# Altium schematic sheet MAX2082_transceiver_V1.0.SchDoc
size 1198 x 708 mm
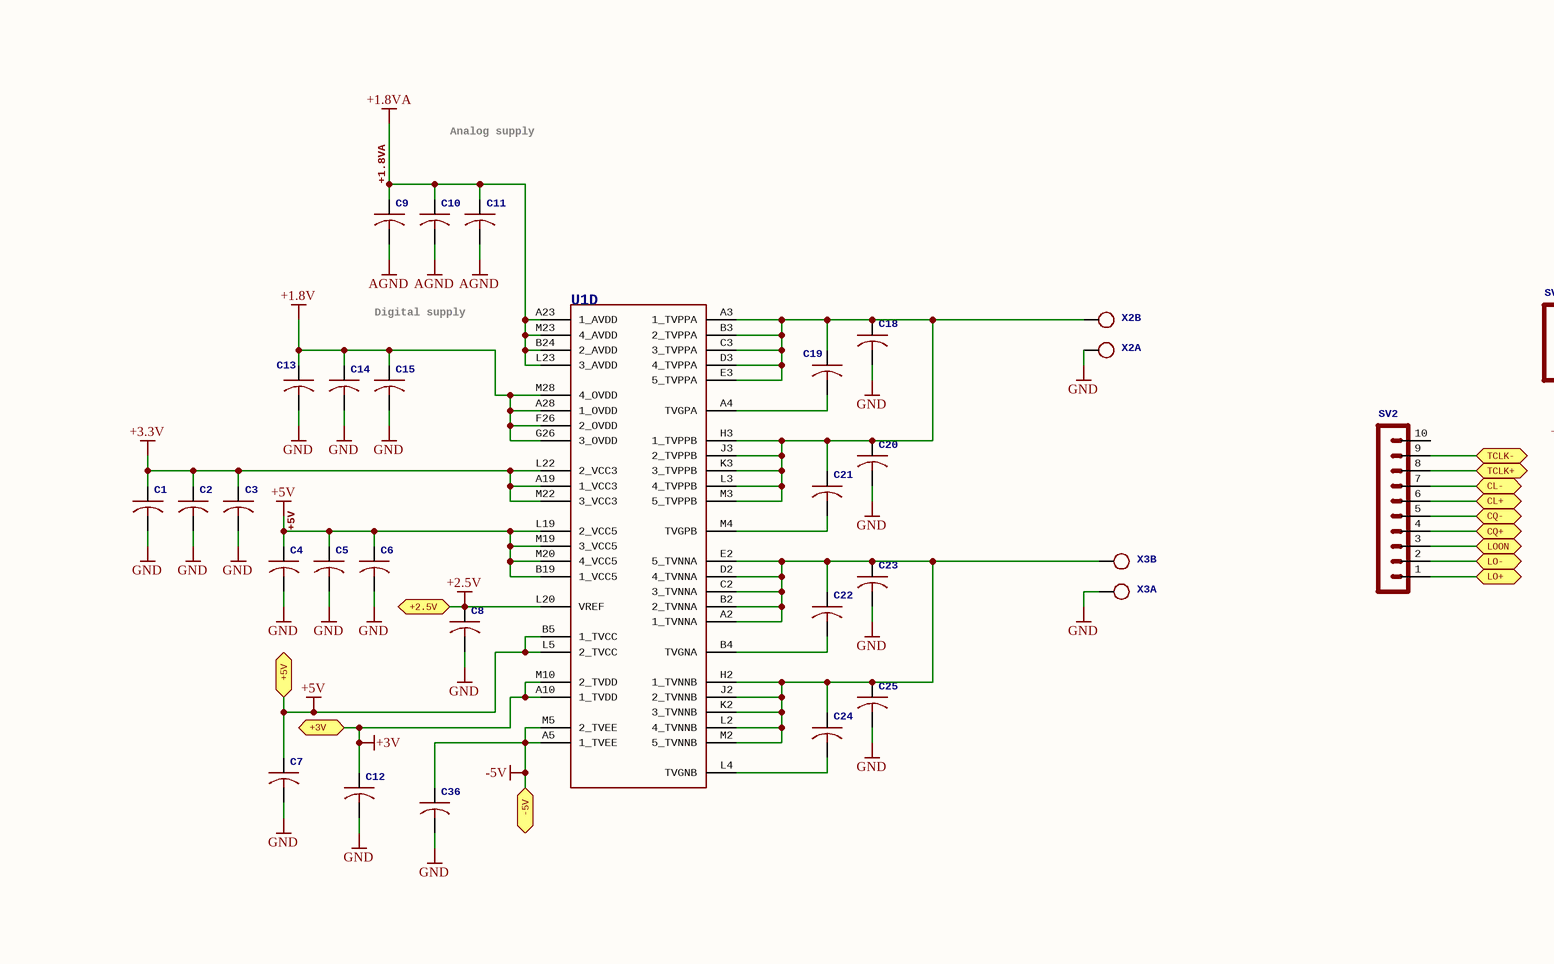
[diagram p0: MAX2082_transceiver_V1.0.SchDoc, top column 1 of 4]
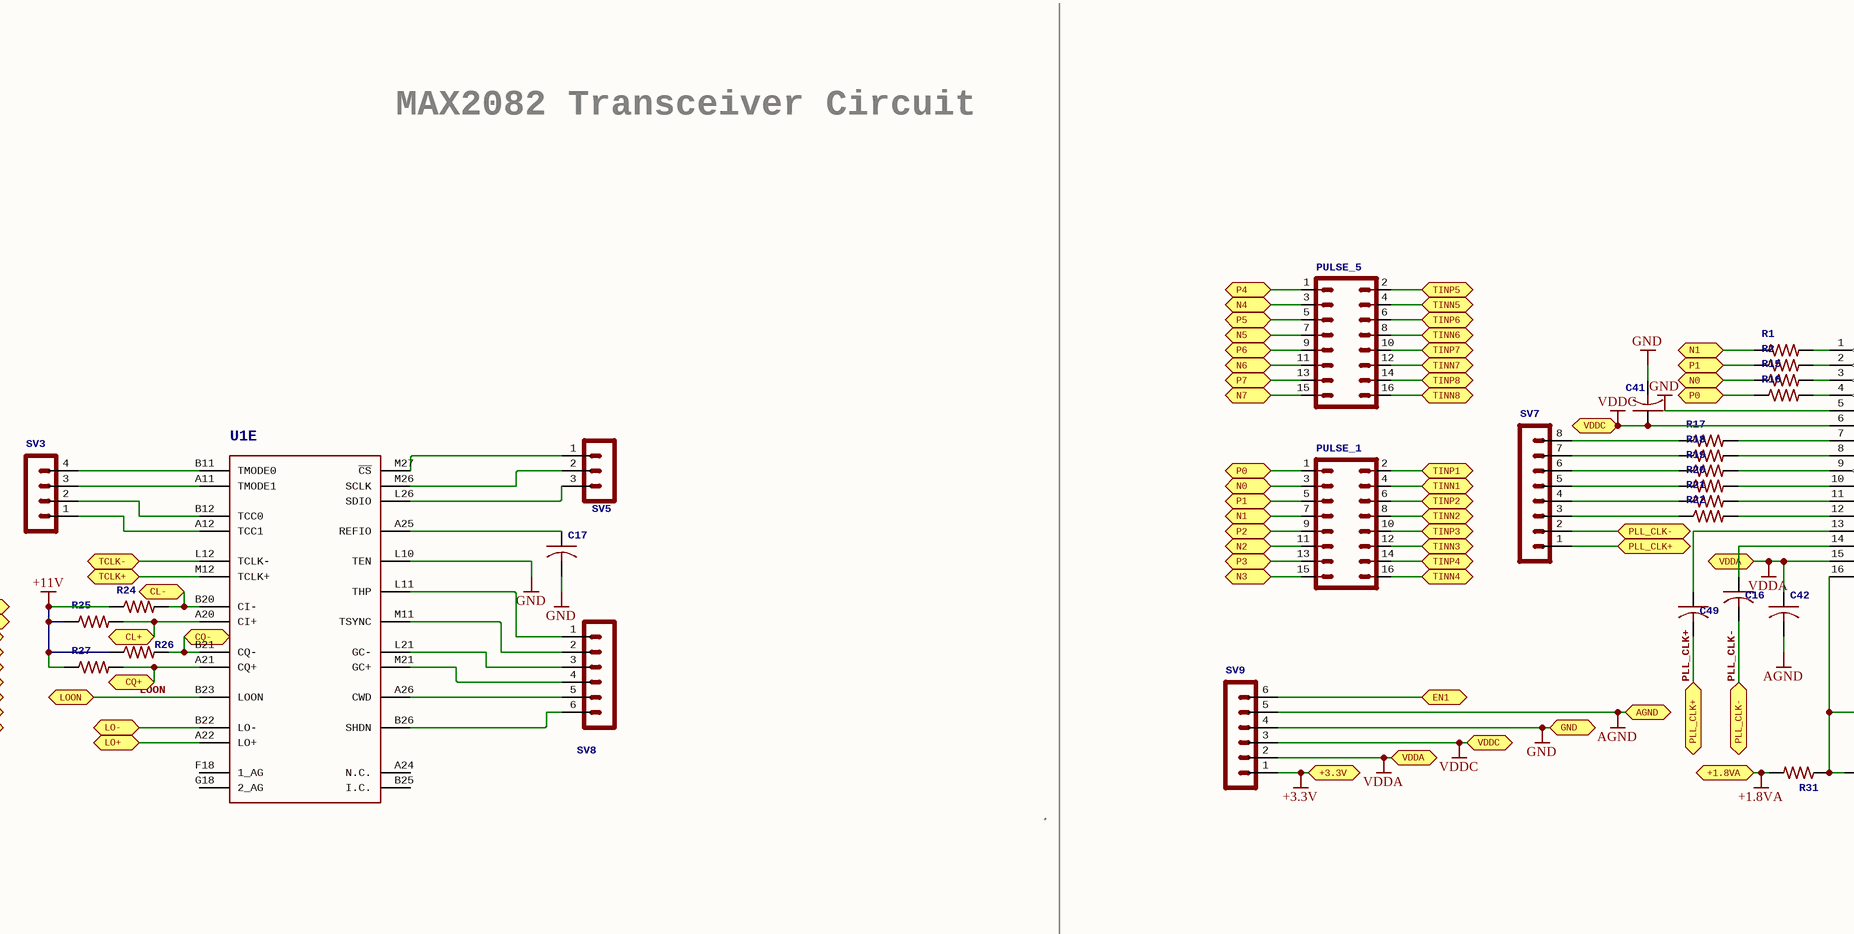
[diagram p1: MAX2082_transceiver_V1.0.SchDoc, top column 2 of 4]
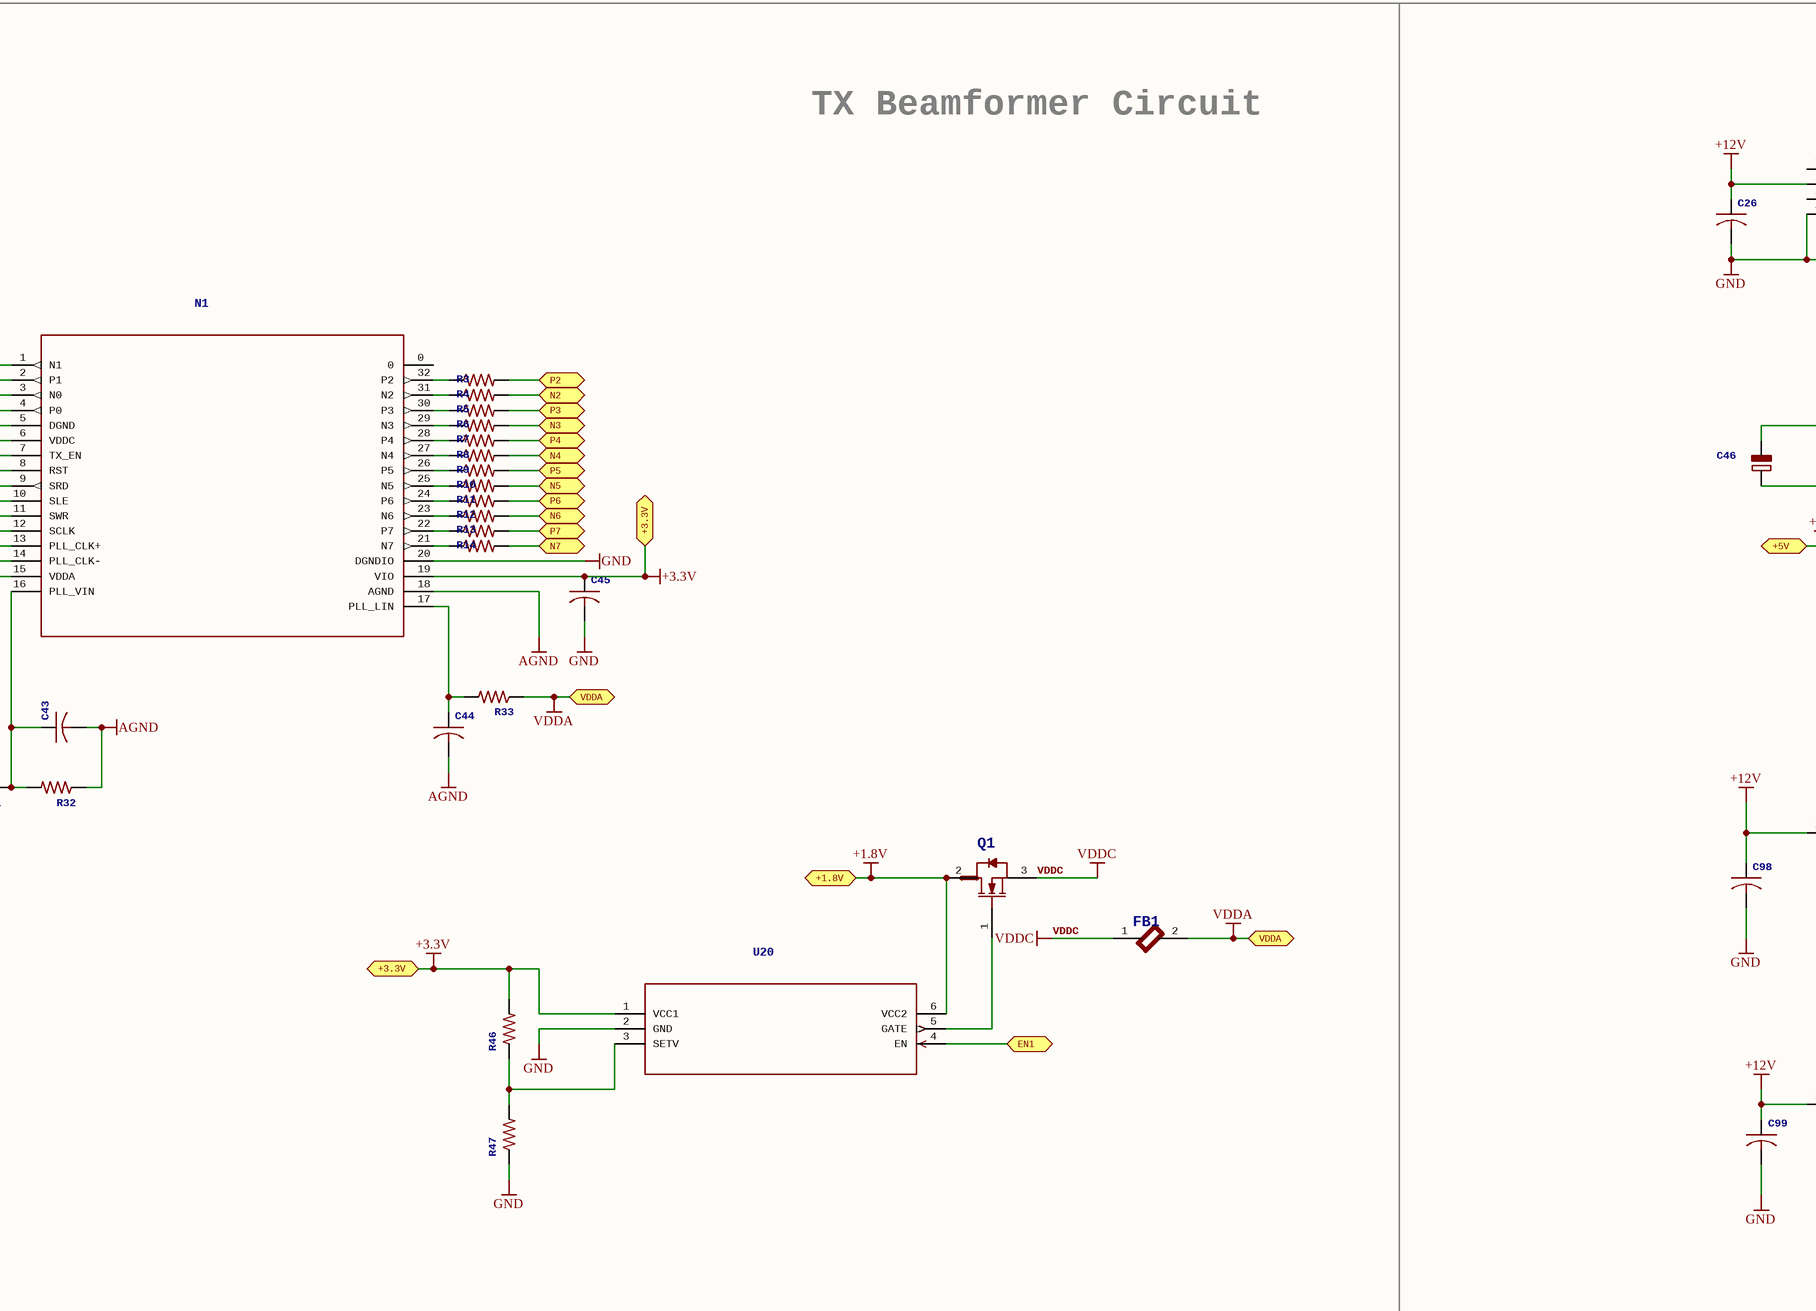
[diagram p2: MAX2082_transceiver_V1.0.SchDoc, top column 3 of 4]
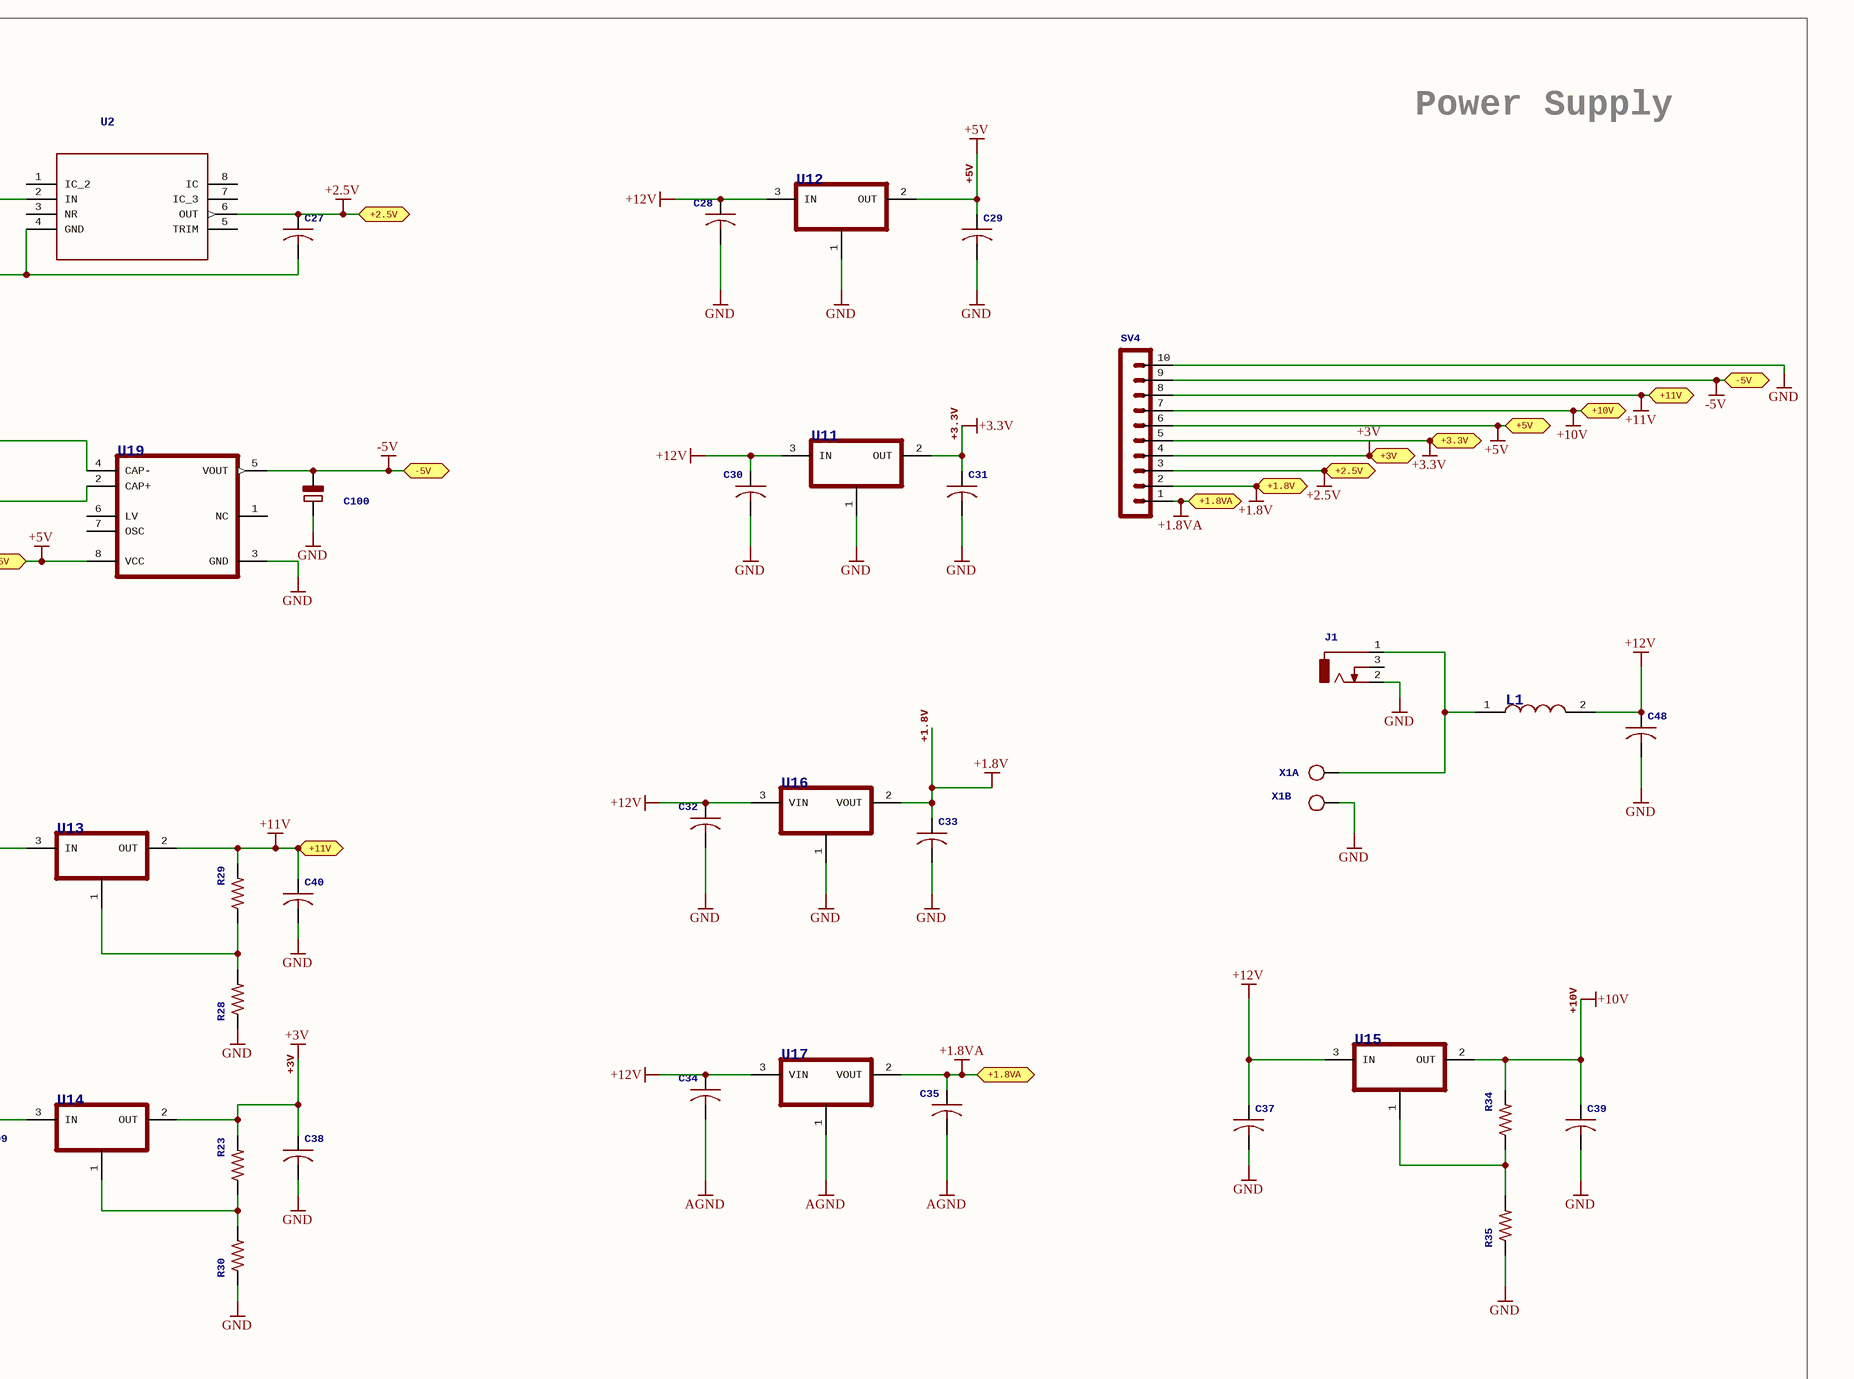
[diagram p3: MAX2082_transceiver_V1.0.SchDoc, top column 4 of 4]
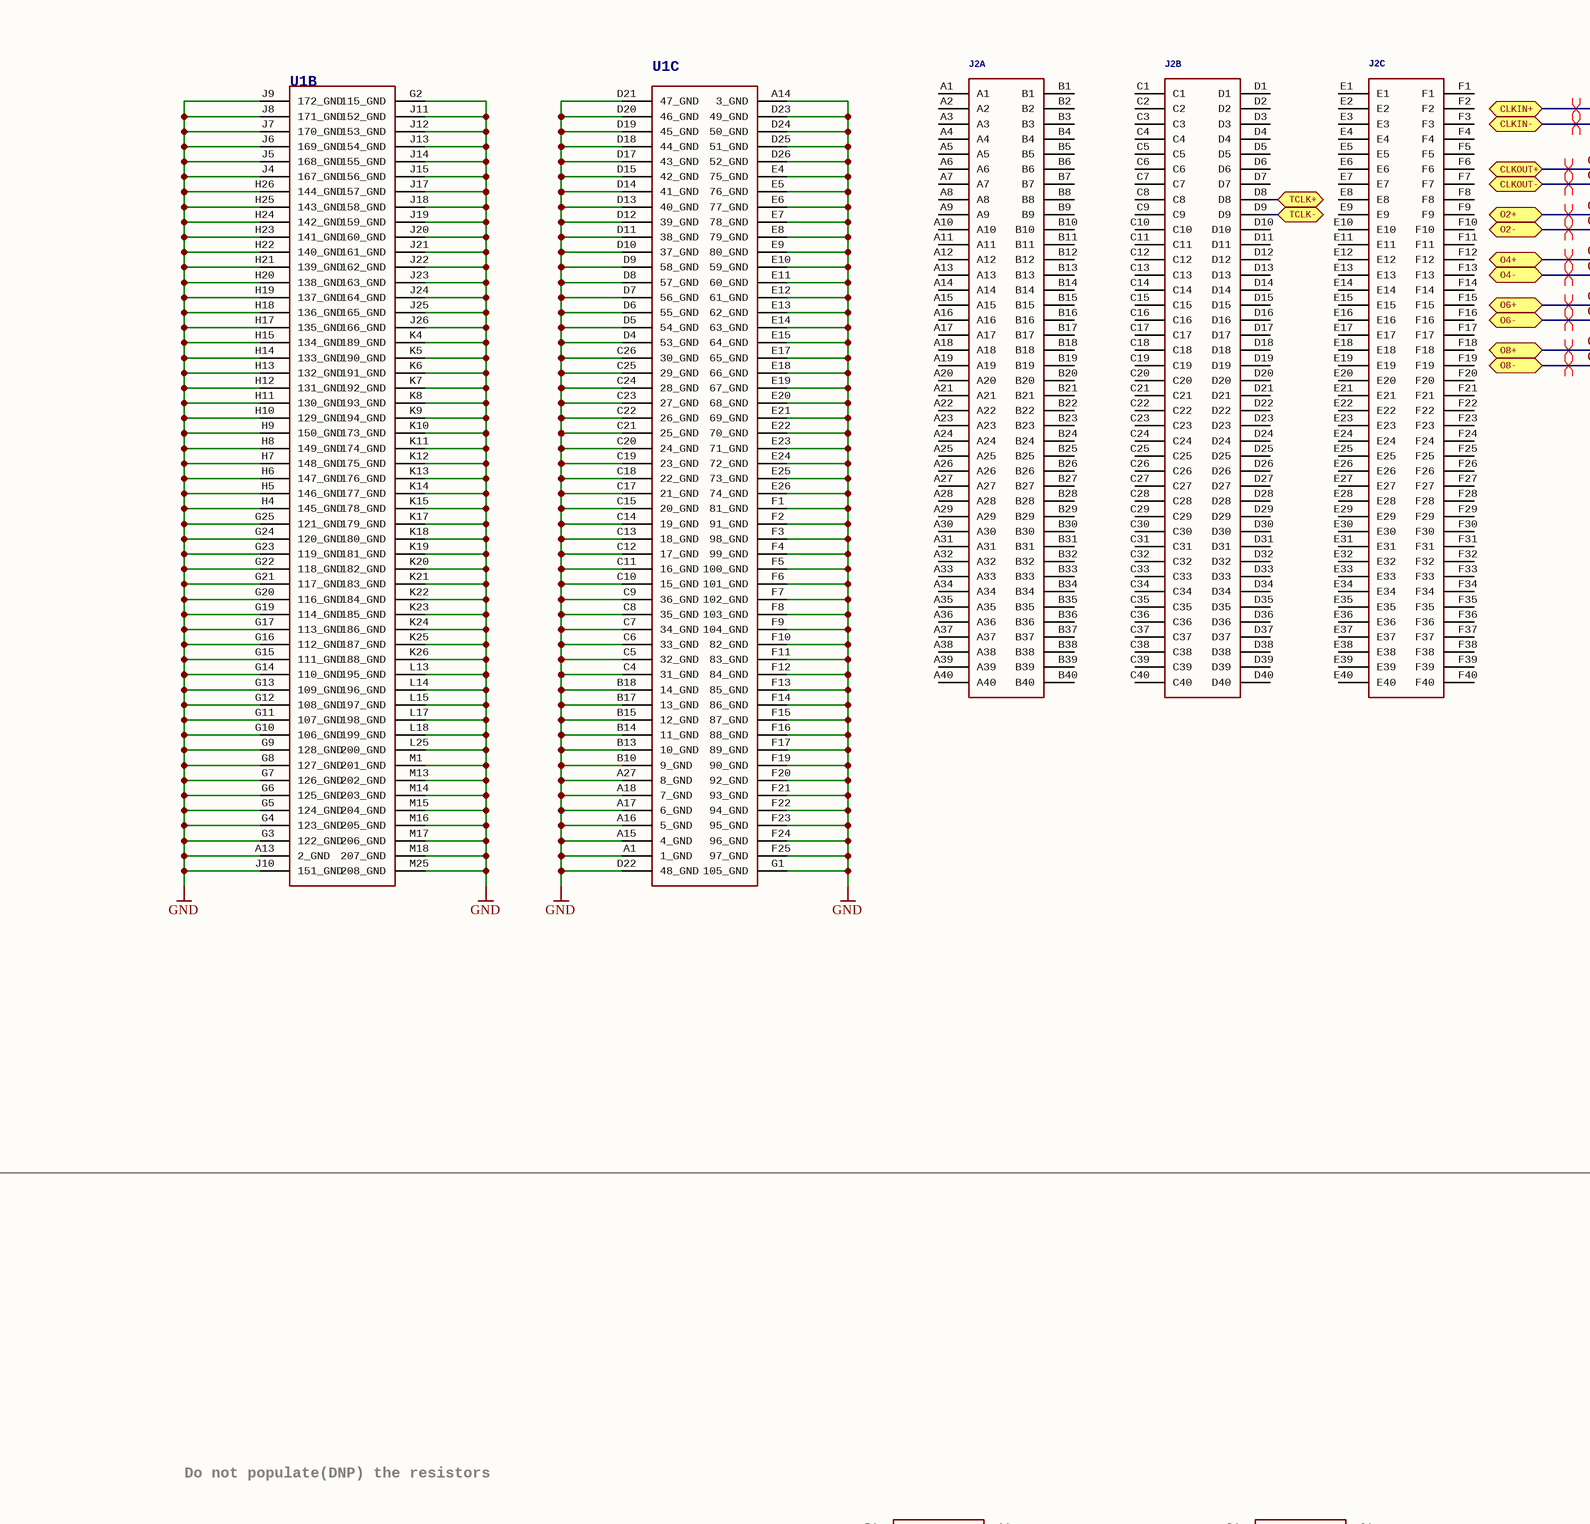
[diagram p4: MAX2082_transceiver_V1.0.SchDoc, centre column 1 of 4]
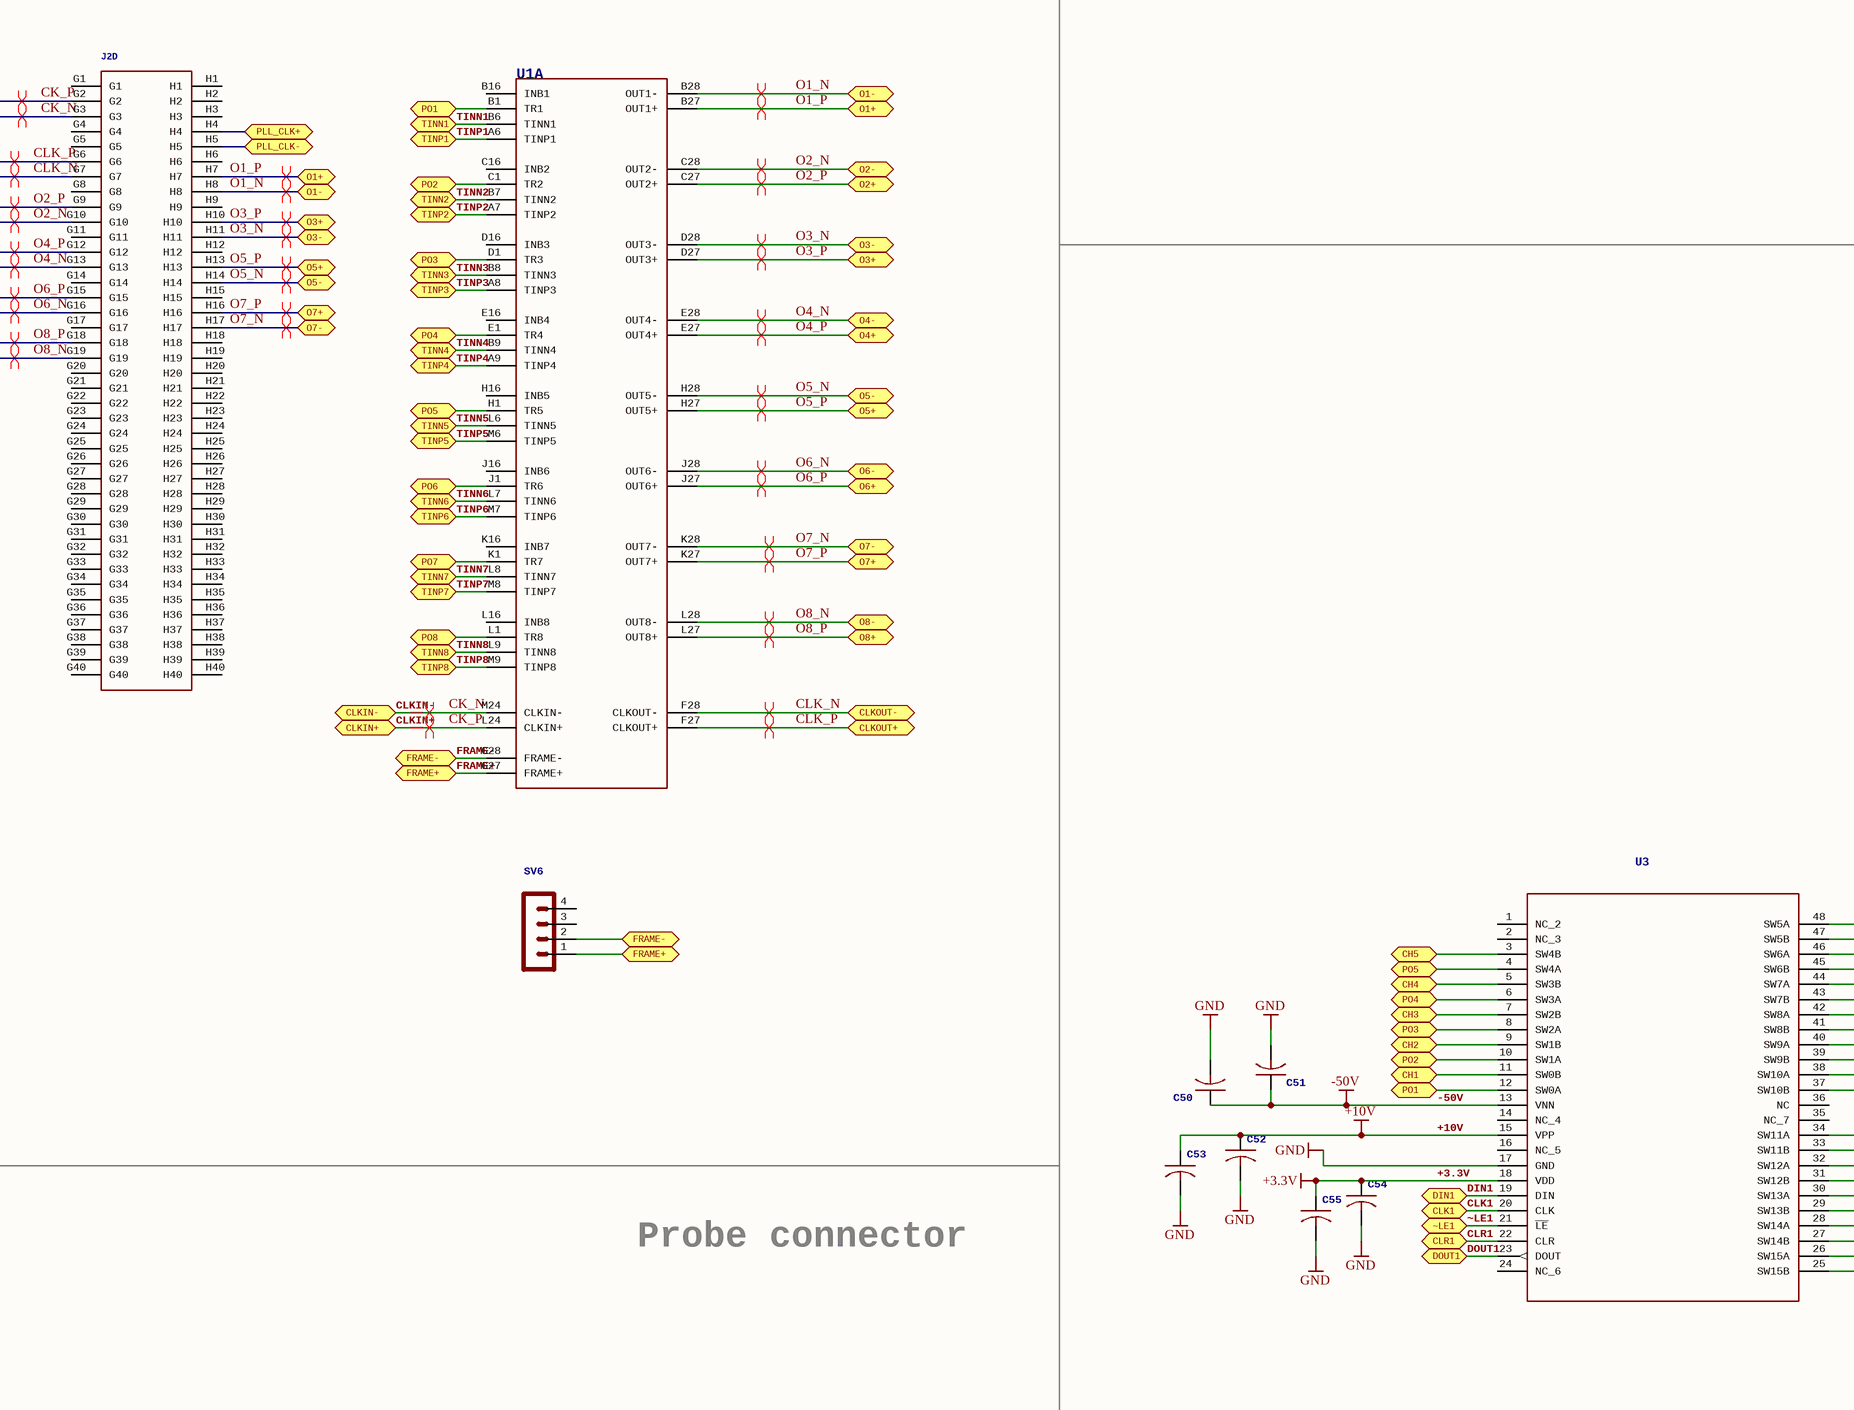
[diagram p5: MAX2082_transceiver_V1.0.SchDoc, centre column 2 of 4]
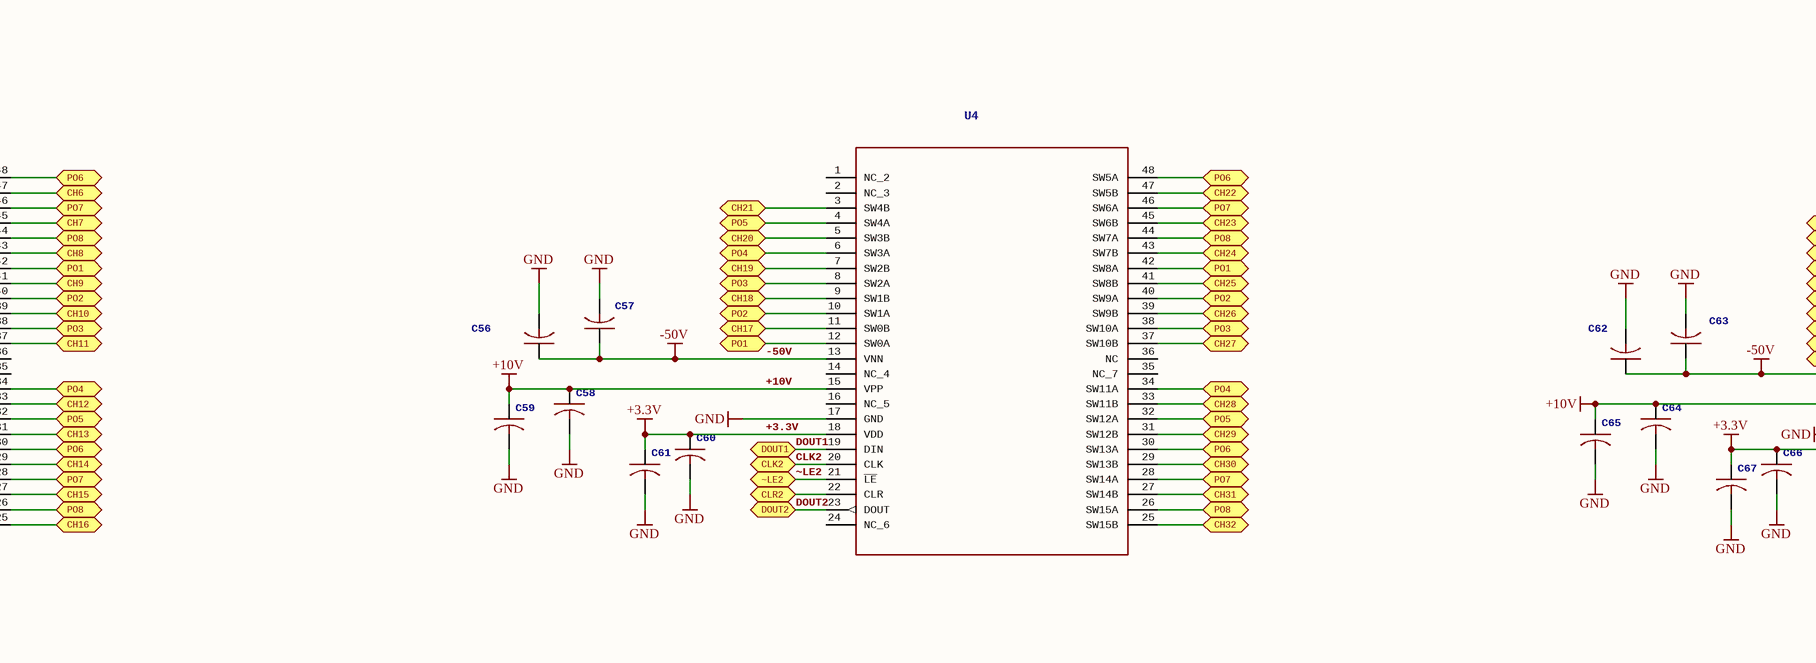
[diagram p6: MAX2082_transceiver_V1.0.SchDoc, centre column 3 of 4]
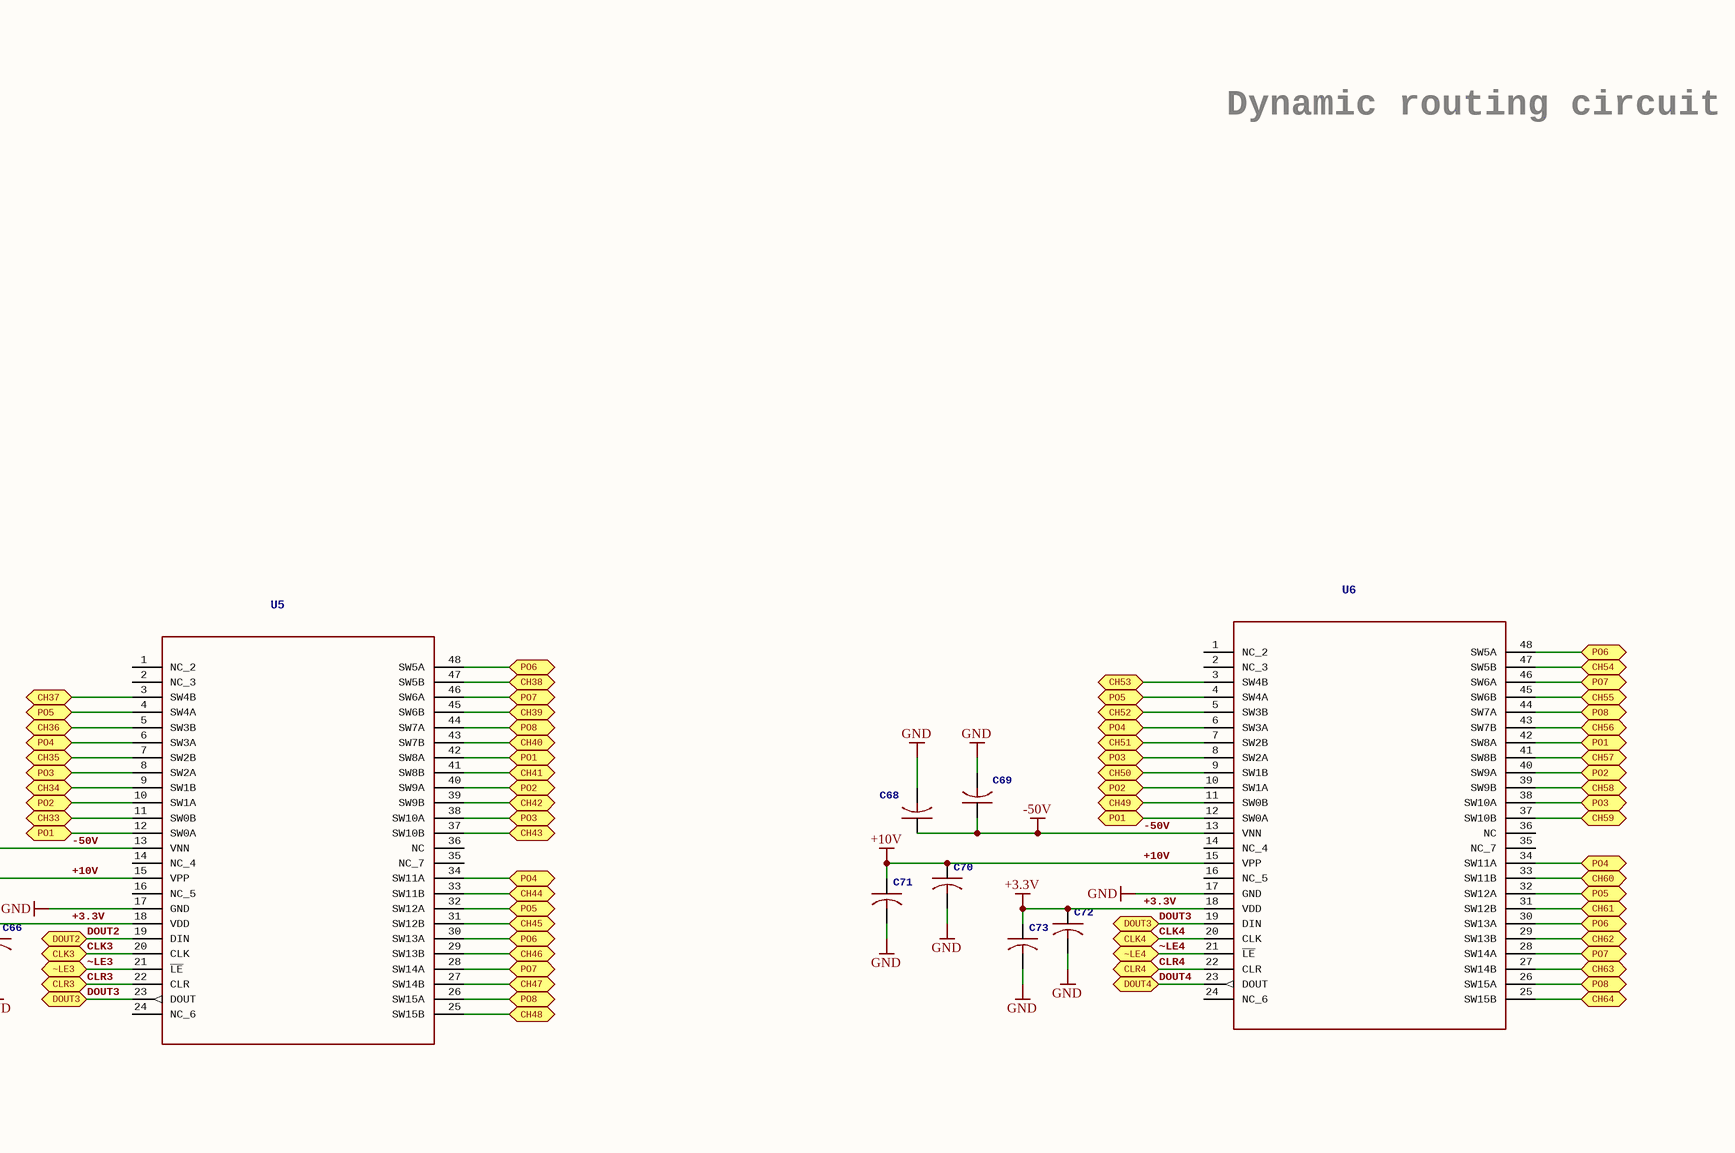
[diagram p7: MAX2082_transceiver_V1.0.SchDoc, centre column 4 of 4]
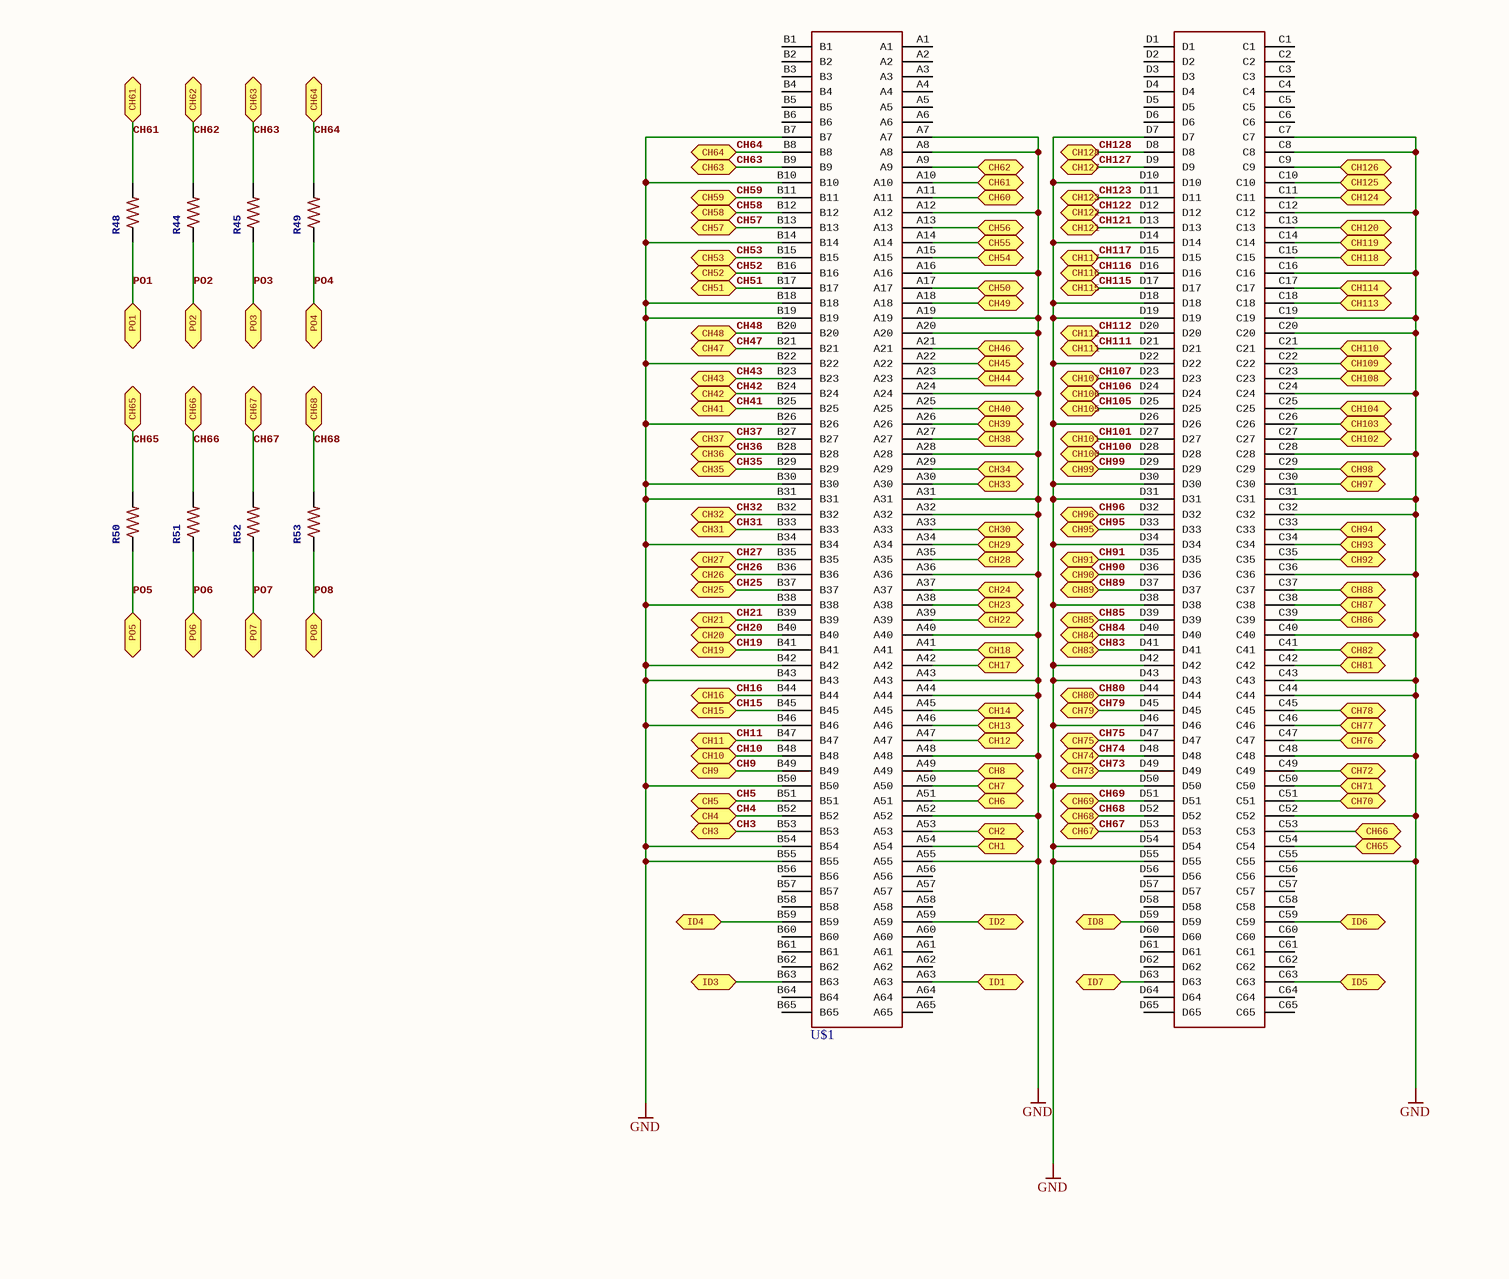
[diagram p8: MAX2082_transceiver_V1.0.SchDoc, bottom column 1 of 4]
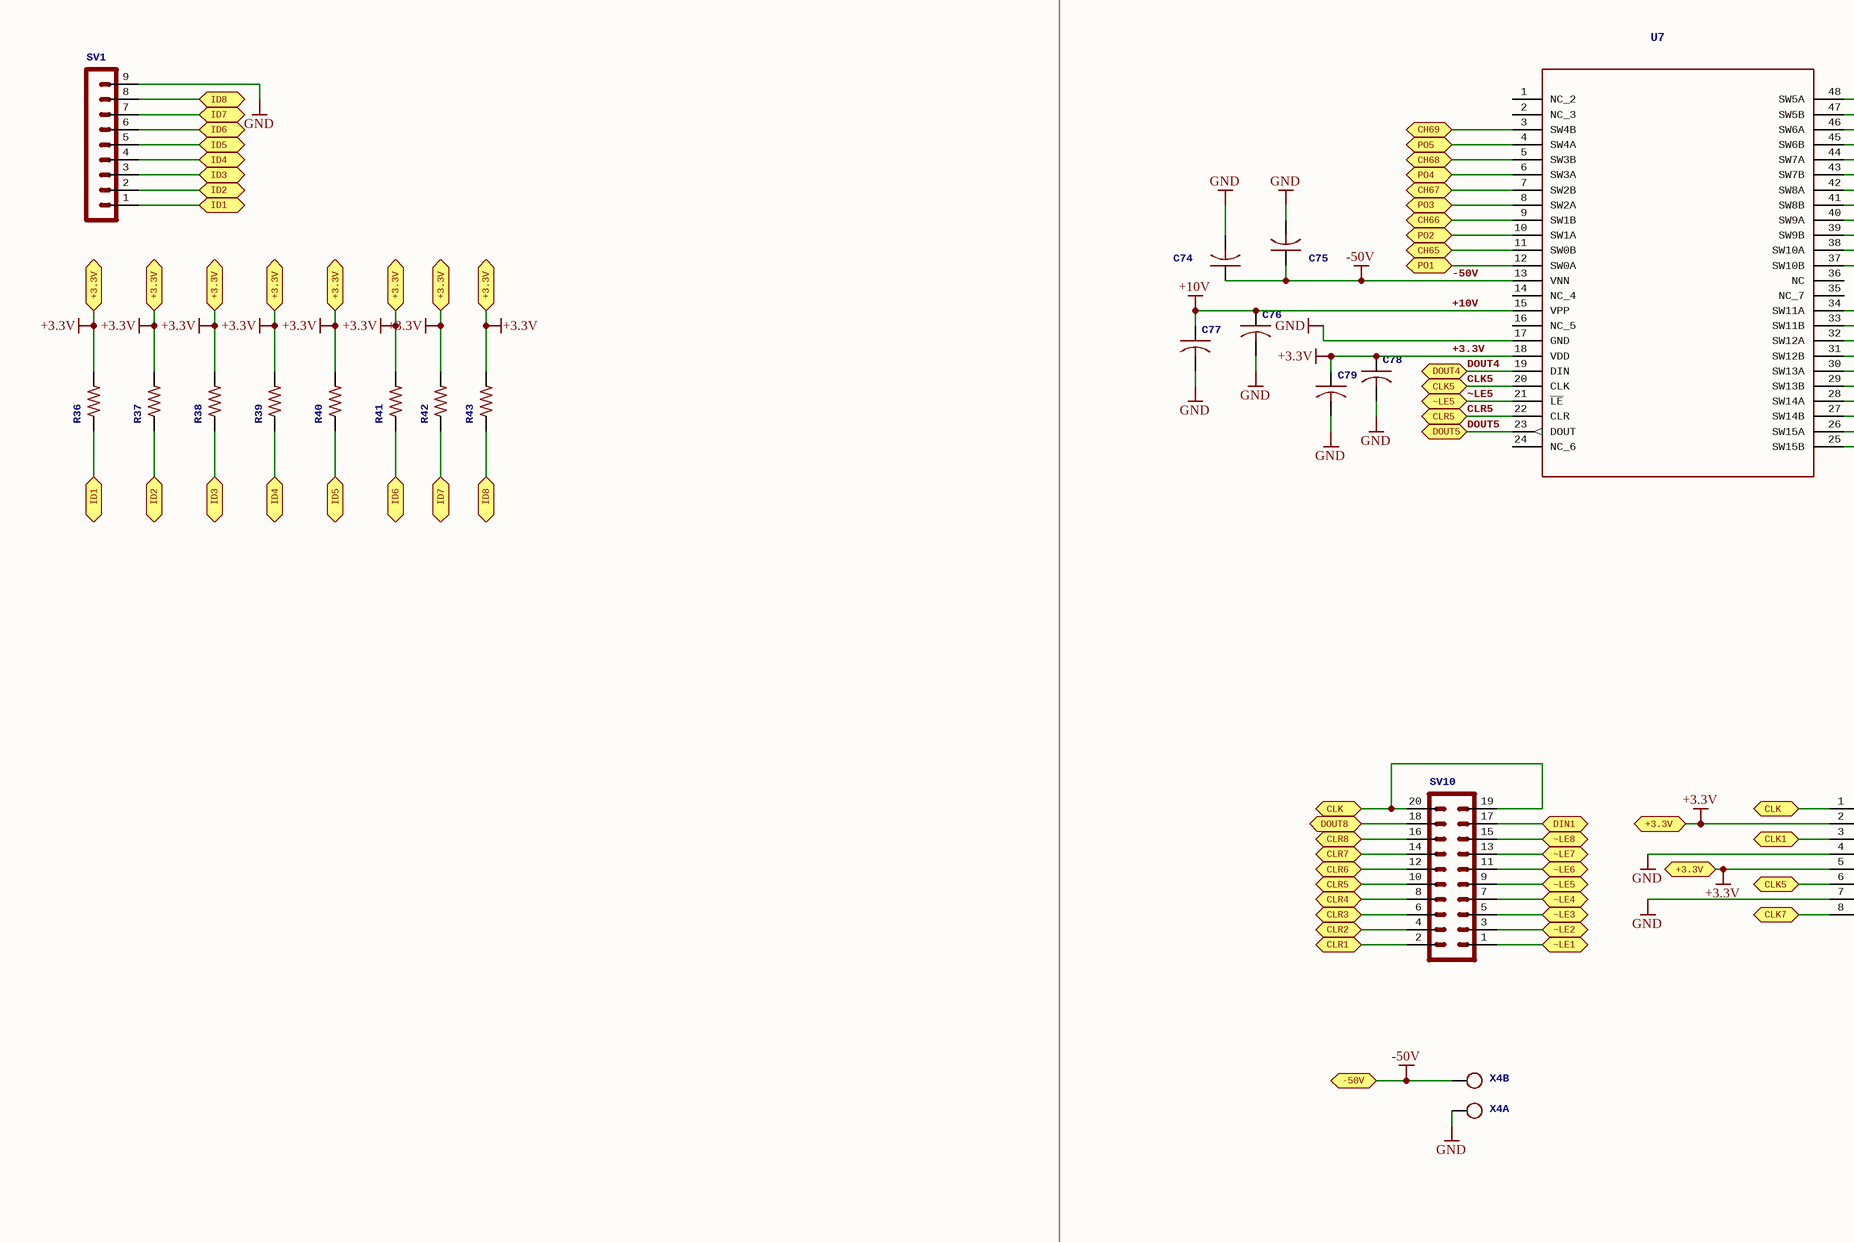
[diagram p9: MAX2082_transceiver_V1.0.SchDoc, bottom column 2 of 4]
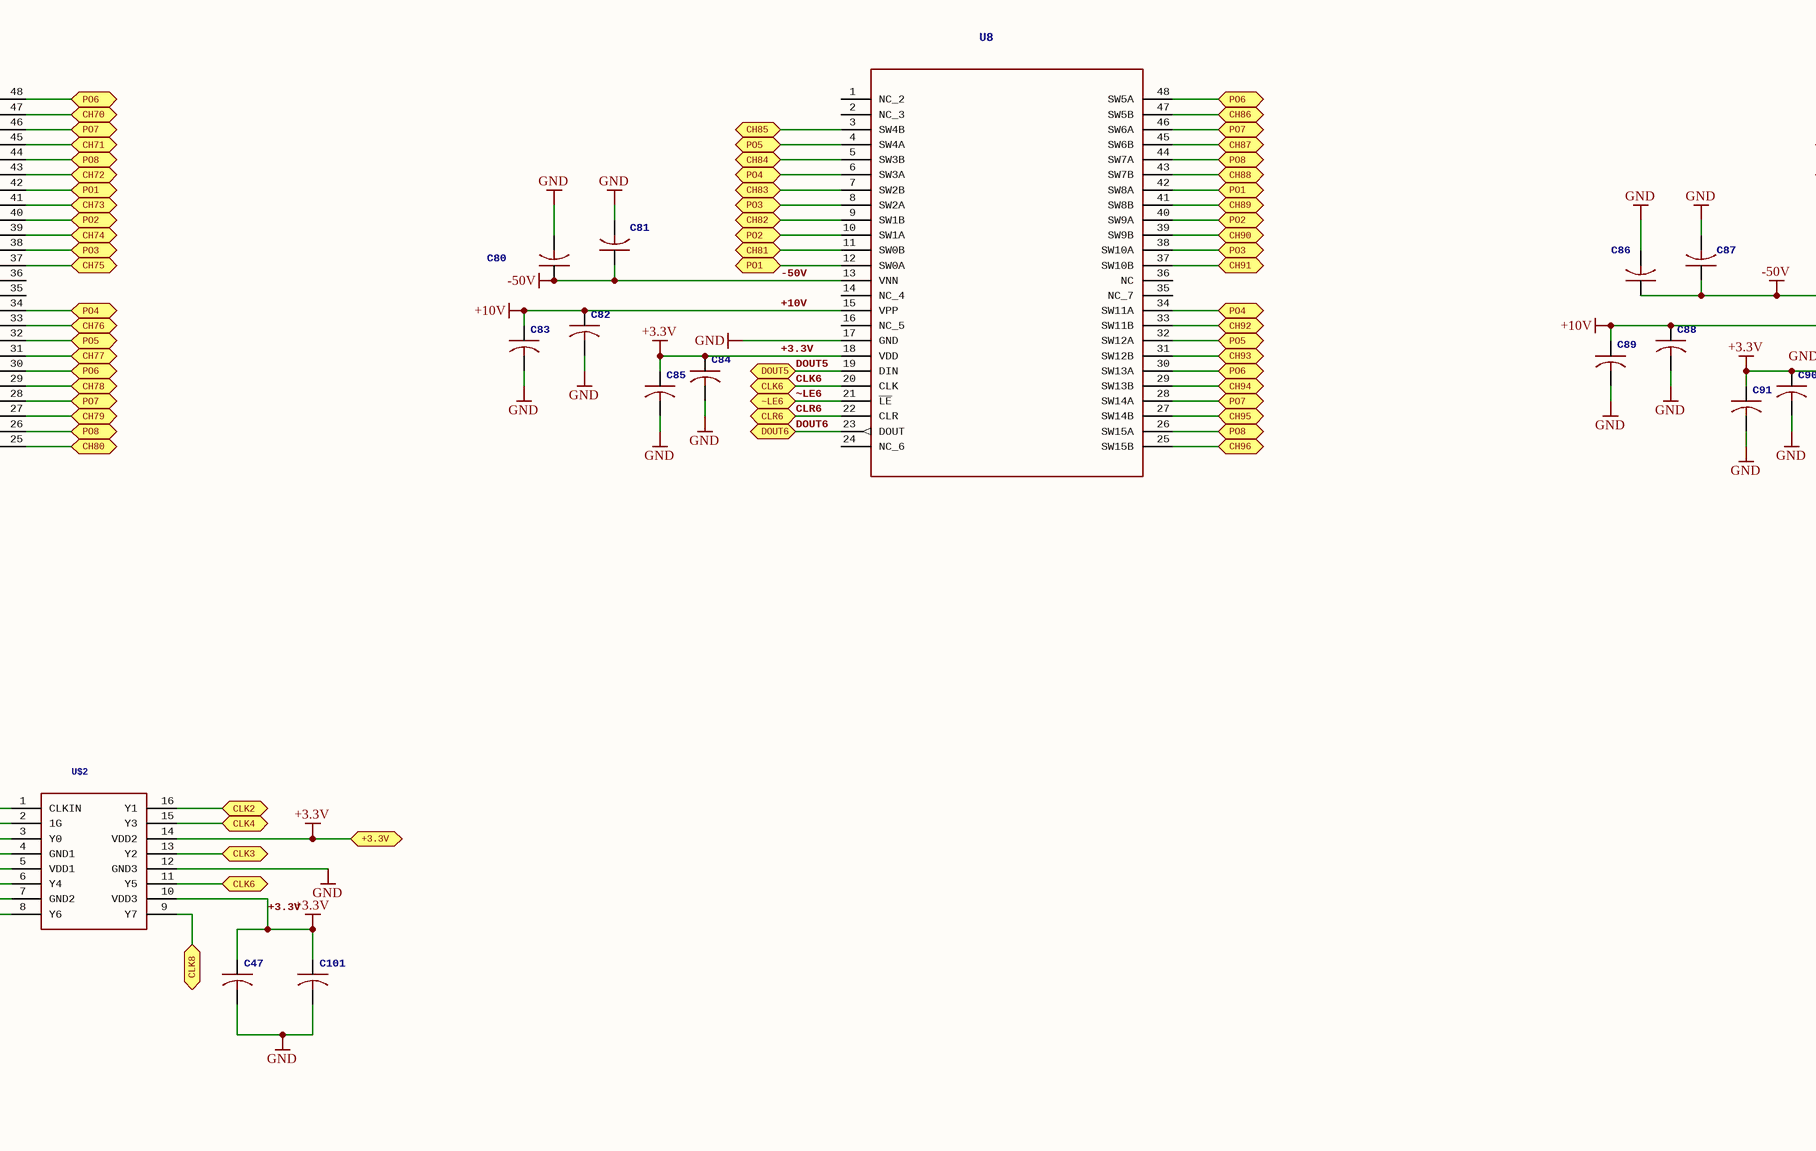
[diagram p10: MAX2082_transceiver_V1.0.SchDoc, bottom column 3 of 4]
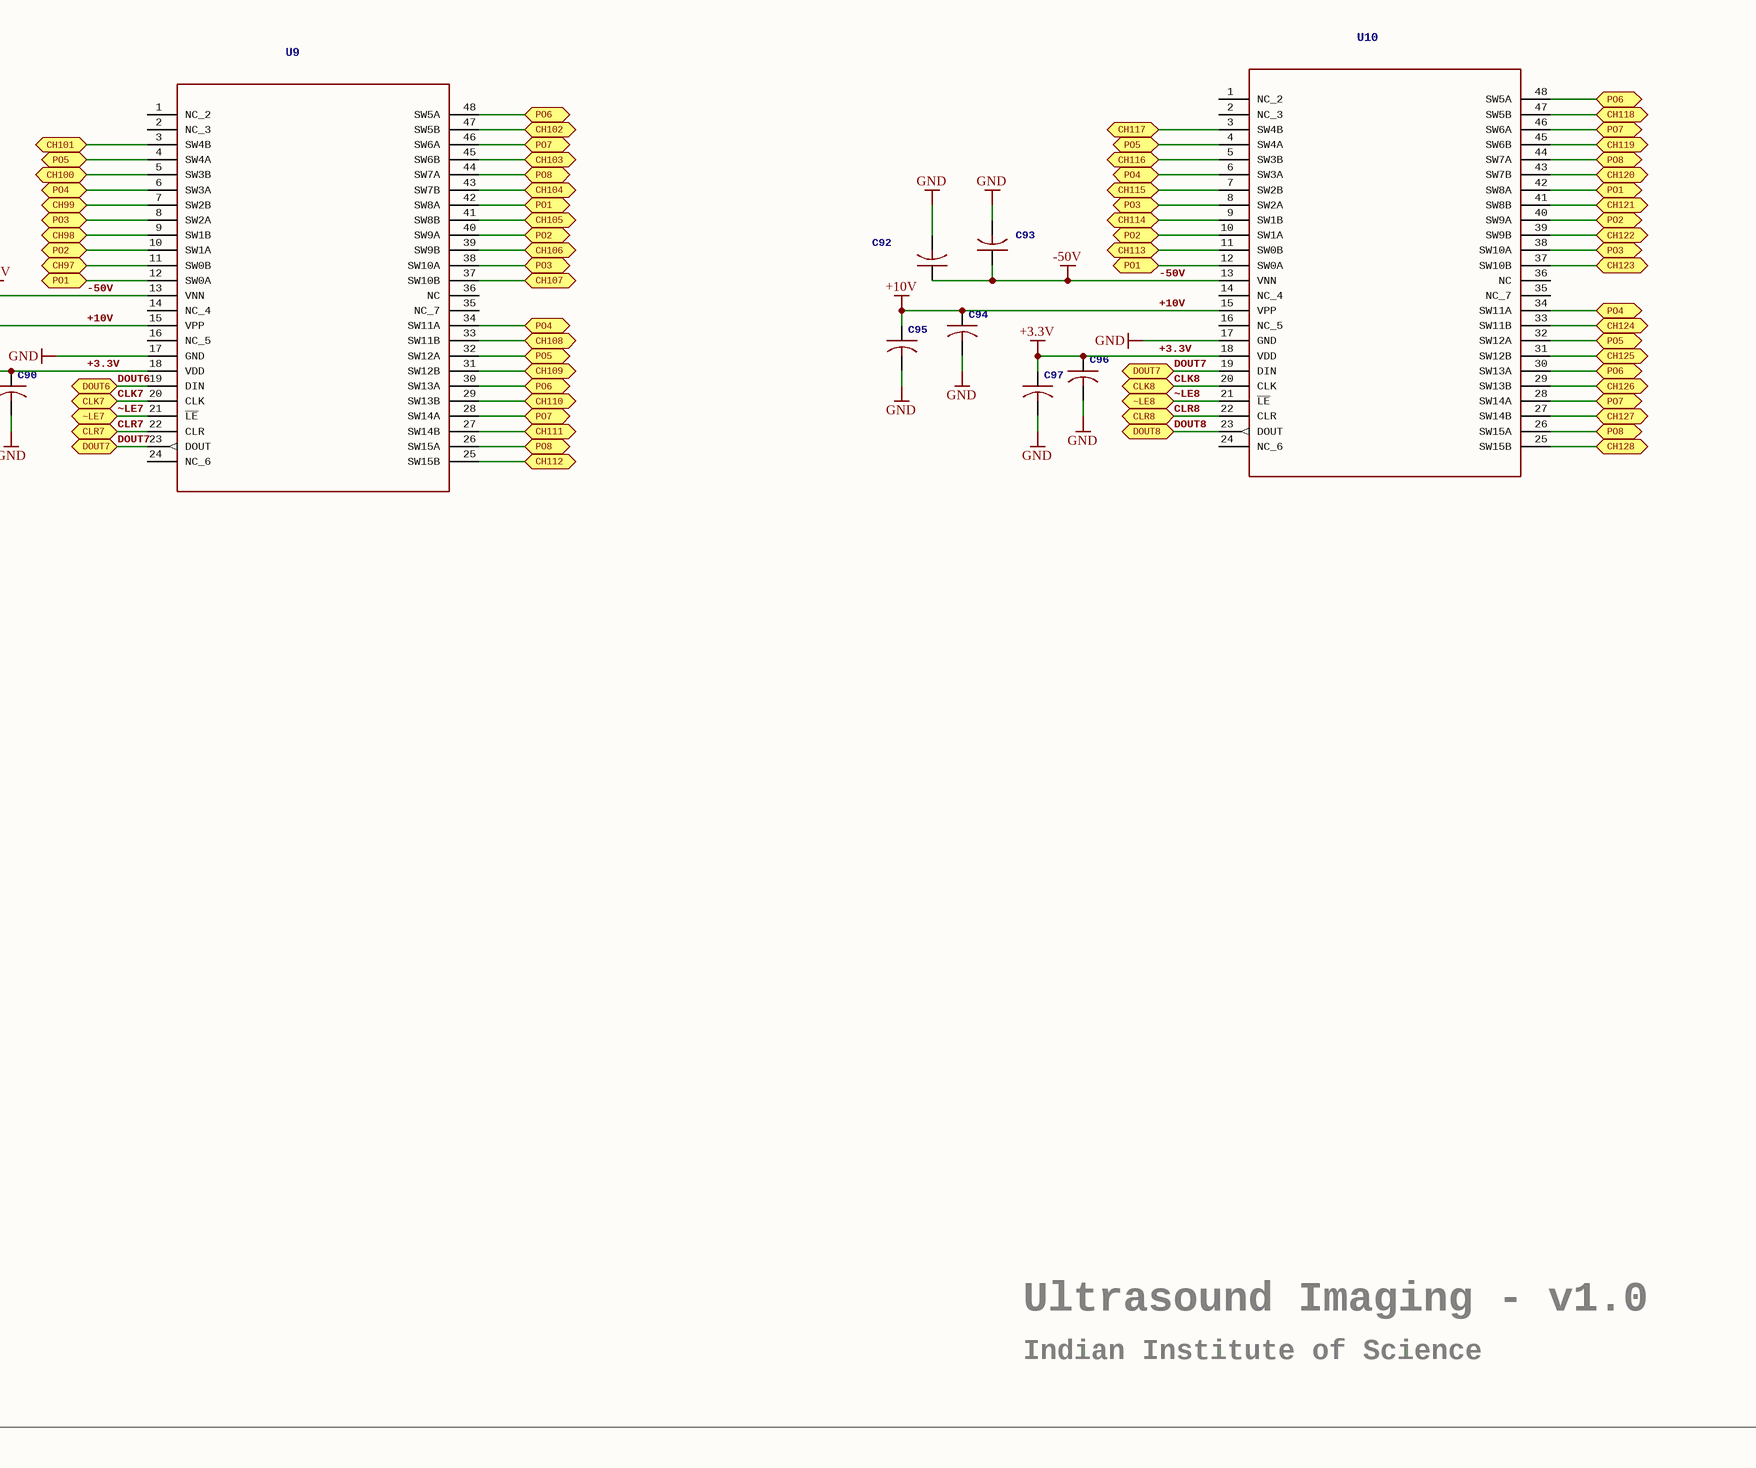
[diagram p11: MAX2082_transceiver_V1.0.SchDoc, bottom column 4 of 4]

## Parts
C1  (no value)  [C0805]
C2  (no value)  [C0805]
C3  (no value)  [C0805]
C4  (no value)  [C0805]
C5  (no value)  [C0805]
C6  (no value)  [C0805]
C7  (no value)  [C0805]
C8  (no value)  [C0805]
C9  (no value)  [C0805]
C10  (no value)  [C0805]
C11  (no value)  [C0805]
C12  (no value)  [C0805]
C13  (no value)  [C0805]
C14  (no value)  [C0805]
C15  (no value)  [C0805]
C16  (no value)  [C0805]
C17  (no value)  [C0805]
C18  (no value)  [C0805]
C19  (no value)  [C0805]
C20  (no value)  [C0805]
C21  (no value)  [C0805]
C22  (no value)  [C0805]
C23  (no value)  [C0805]
C24  (no value)  [C0805]
C25  (no value)  [C0805]
C26  (no value)  [C0805]
C27  (no value)  [C0805]
C28  (no value)  [C0805]
C29  (no value)  [C0805]
C30  (no value)  [C0805]
C31  (no value)  [C0805]
C32  (no value)  [C0805]
C33  (no value)  [C0805]
C34  (no value)  [C0805]
C35  (no value)  [C0805]
C36  (no value)  [C0805]
C37  (no value)  [C0805]
C38  (no value)  [C0805]
C39  (no value)  [C0805]
C40  (no value)  [C0805]
C41  (no value)  [C0805]
C42  (no value)  [C0805]
C43  (no value)  [C0805]
C44  (no value)  [C0805]
C45  (no value)  [C0805]
C46  (no value)  [C46,C100]
C47  (no value)  [C0805]
C48  (no value)  [C0805]
C49  (no value)  [C0805]
C50  (no value)  [C0805]
C51  (no value)  [C0805]
C52  (no value)  [C0805]
C53  (no value)  [C0805]
C54  (no value)  [C0805]
C55  (no value)  [C0805]
C56  (no value)  [C0805]
C57  (no value)  [C0805]
C58  (no value)  [C0805]
C59  (no value)  [C0805]
C60  (no value)  [C0805]
C61  (no value)  [C0805]
C62  (no value)  [C0805]
C63  (no value)  [C0805]
C64  (no value)  [C0805]
C65  (no value)  [C0805]
C66  (no value)  [C0805]
C67  (no value)  [C0805]
C68  (no value)  [C0805]
C69  (no value)  [C0805]
C70  (no value)  [C0805]
C71  (no value)  [C0805]
C72  (no value)  [C0805]
C73  (no value)  [C0805]
C74  (no value)  [C0805]
C75  (no value)  [C0805]
C76  (no value)  [C0805]
C77  (no value)  [C0805]
C78  (no value)  [C0805]
C79  (no value)  [C0805]
C80  (no value)  [C0805]
C81  (no value)  [C0805]
C82  (no value)  [C0805]
C83  (no value)  [C0805]
C84  (no value)  [C0805]
C85  (no value)  [C0805]
C86  (no value)  [C0805]
C87  (no value)  [C0805]
C88  (no value)  [C0805]
C89  (no value)  [C0805]
C90  (no value)  [C0805]
C91  (no value)  [C0805]
C92  (no value)  [C0805]
C93  (no value)  [C0805]
C94  (no value)  [C0805]
C95  (no value)  [C0805]
C96  (no value)  [C0805]
C97  (no value)  [C0805]
C98  (no value)  [C0805]
C99  (no value)  [C0805]
C100  (no value)  [C46,C100]
C101  (no value)  [C0805]
FB1  (no value)  [FB1]
J1  (no value)  [J1]
J2  (no value)  [J2]  (parts A,B,C,D of 5)
L1  (no value)  [L1              0805]
N1  (no value)  [N1]
PULSE_1  (no value)  [PULSE_1,PULSE_5]
PULSE_5  (no value)  [PULSE_1,PULSE_5]
Q1  (no value)  [Q1               SOT-223]
R1  (no value)  [R0805]
R2  (no value)  [R0805]
R3  (no value)  [R0805]
R4  (no value)  [R0805]
R5  (no value)  [R0805]
R6  (no value)  [R0805]
R7  (no value)  [R0805]
R8  (no value)  [R0805]
R9  (no value)  [R0805]
R10  (no value)  [R0805]
R11  (no value)  [R0805]
R12  (no value)  [R0805]
R13  (no value)  [R0805]
R14  (no value)  [R0805]
R15  (no value)  [R0805]
R16  (no value)  [R0805]
R17  (no value)  [R0805]
R18  (no value)  [R0805]
R19  (no value)  [R0805]
R20  (no value)  [R0805]
R21  (no value)  [R0805]
R22  (no value)  [R0805]
R23  (no value)  [R0805]
R24  (no value)  [R0805]
R25  (no value)  [R0805]
R26  (no value)  [R0805]
R27  (no value)  [R0805]
R28  (no value)  [R0805]
R29  (no value)  [R0805]
R30  (no value)  [R0805]
R31  (no value)  [R0805]
R32  (no value)  [R0805]
R33  (no value)  [R0805]
R34  (no value)  [R0805]
R35  (no value)  [R0805]
R36  (no value)  [R0805]
R37  (no value)  [R0805]
R38  (no value)  [R0805]
R39  (no value)  [R0805]
R40  (no value)  [R0805]
R41  (no value)  [R0805]
R42  (no value)  [R0805]
R43  (no value)  [R0805]
R44  (no value)  [R0805]
R45  (no value)  [R0805]
R46  (no value)  [R0805]
R47  (no value)  [R0805]
R48  (no value)  [R0805]
R49  (no value)  [R0805]
R50  (no value)  [R0805]
R51  (no value)  [R0805]
R52  (no value)  [R0805]
R53  (no value)  [R0805]
SV1  (no value)  [SV1]
SV2  (no value)  [SV2,SV4]
SV3  (no value)  [SV3,SV6]
SV4  (no value)  [SV2,SV4]
SV5  (no value)  [SV5]
SV6  (no value)  [SV3,SV6]
SV7  (no value)  [SV7]
SV8  (no value)  [SV8,SV9]
SV9  (no value)  [SV8,SV9]
SV10  (no value)  [SV10]
U1  (no value)  [U1]  (parts A,B,C,D,E of 5)
U2  (no value)  [U2]
U3  (no value)  [U3 to U10                           TQFP48]
U4  (no value)  [U3 to U10                           TQFP48]
U5  (no value)  [U3 to U10                           TQFP48]
U6  (no value)  [U3 to U10                           TQFP48]
U7  (no value)  [U3 to U10                           TQFP48]
U8  (no value)  [U3 to U10                           TQFP48]
U9  (no value)  [U3 to U10                           TQFP48]
U10  (no value)  [U3 to U10                           TQFP48]
U11  (no value)  [U11 to U15 ,U16 ,U17       TO-220]
U12  (no value)  [U11 to U15 ,U16 ,U17       TO-220]
U13  (no value)  [U11 to U15 ,U16 ,U17       TO-220]
U14  (no value)  [U11 to U15 ,U16 ,U17       TO-220]
U15  (no value)  [U11 to U15 ,U16 ,U17       TO-220]
U16  (no value)  [U11 to U15 ,U16 ,U17       TO-220]
U17  (no value)  [U11 to U15 ,U16 ,U17       TO-220]
U19  (no value)  [U19]
U20  (no value)  [U20                SOT23-6]
U$1  (no value)  [U$1]
U$2  (no value)  [U$2          TSSOP-16]
X1  (no value)  [X1 to X4]  (parts A,B of 2)
X2  (no value)  [X1 to X4]  (parts A,B of 2)
X3  (no value)  [X1 to X4]  (parts A,B of 2)
X4  (no value)  [X1 to X4]  (parts A,B of 2)

## Ports
+1.8V, +1.8VA, +2.5V, +3.3V, +3V, +5V, +10V, +11V, -5V, -50V, AGND, CH1, CH2, CH3, CH4, CH5, CH6, CH7, CH8, CH9, CH10, CH11, CH12, CH13, CH14, CH15, CH16, CH17, CH18, CH19, CH20, CH21, CH22, CH23, CH24, CH25, CH26, CH27, CH28, CH29, CH30, CH31, CH32, CH33, CH34, CH35, CH36, CH37, CH38, CH39, CH40, CH41, CH42, CH43, CH44, CH45, CH46, CH47, CH48, CH49, CH50, CH51, CH52, CH53, CH54, CH55, CH56, CH57, CH58, CH59, CH60, CH61, CH62, CH63, CH64, CH65, CH66, CH67, CH68, CH69, CH70, CH71, CH72, CH73, CH74, CH75, CH76, CH77, CH78, CH79, CH80, CH81, CH82, CH83, CH84, CH85, CH86, CH87, CH88, CH89, CH90, CH91, CH92, CH93, CH94, CH95, CH96, CH97, CH98, CH99, CH100, CH101, CH102, CH103, CH104, CH105, CH106, CH107, CH108, CH109, CH110, CH111, CH112, CH113, CH114, CH115, CH116, CH117, CH118, CH119, CH120, CH121, CH122, CH123, CH124, CH125, CH126, CH127, CH128, CL+, CL-, CLK, CLK1, CLK2, CLK3, CLK4, CLK5, CLK6, CLK7, CLK8, CLKIN+, CLKIN-, CLKOUT+, CLKOUT-, CLR1, CLR2, CLR3, CLR4, CLR5, CLR6, CLR7, CLR8, CQ+, CQ-, DIN1, DOUT1, DOUT2, DOUT3, DOUT4, DOUT5, DOUT6, DOUT7, DOUT8, EN1, FRAME+, FRAME-, GND, ID1, ID2, ID3, ID4, ID5, ID6, ID7, ID8, LO+, LO-, LOON, N0, N1, N2, N3, N4, N5, N6, N7, O1+, O1-, O2+, O2-, O3+, O3-, O4+, O4-, O5+, O5-, O6+, O6-, O7+, O7-, O8+, O8-, P0, P1, P2, P3, P4, P5, P6, P7, PLL_CLK+, PLL_CLK-, PO1, PO2, PO3, PO4, PO5, PO6, PO7, PO8, TCLK+, TCLK-, TINN1, TINN2, TINN3, TINN4, TINN5, TINN6, TINN7, TINN8, TINP1, TINP2, TINP3, TINP4, TINP5, TINP6, TINP7, TINP8, VDDA, VDDC, ~LE1, ~LE2, ~LE3, ~LE4, ~LE5, ~LE6, ~LE7, ~LE8

## Nets
+1.8V: C13.1 C14.1 C15.1 C33.1 Q1.2(1_D) SV4.2 U1.A28(1_OVDD) U1.F26(2_OVDD) U1.G26(3_OVDD) U1.M28(4_OVDD) U16.2(VOUT) U20.6(VCC2) ; port +1.8V
+1.8VA: C9.1 C10.1 C11.1 C35.1 R31.2 SV4.1 U1.A23(1_AVDD) U1.B24(2_AVDD) U1.L23(3_AVDD) U1.M23(4_AVDD) U17.2(VOUT) ; port +1.8VA
+2.5V: C8.1 C27.1 SV4.3 U1.L20(VREF) U2.6(OUT) ; port +2.5V
+3.3V: C1.1 C2.1 C3.1 C31.1 C45.1 C47.1 C54.1 C55.1 C60.1 C61.1 C66.1 C67.1 C72.1 C73.1 C78.1 C79.1 C84.1 C85.1 C90.1 C91.1 C96.1 C97.1 C101.1 N1.19(VIO) R36.2 R37.2 R38.2 R39.2 R40.2 R41.2 R42.2 R43.2 R46.2 SV4.5 SV9.1 U1.A19(1_VCC3) U1.L22(2_VCC3) U1.M22(3_VCC3) U3.18(VDD) U4.18(VDD) U5.18(VDD) U6.18(VDD) U7.18(VDD) U8.18(VDD) U9.18(VDD) U10.18(VDD) U11.2(OUT) U20.1(VCC1) U$2.2(1G) U$2.5(VDD1) U$2.10(VDD3) U$2.14(VDD2) ; port +3.3V
+3V: C12.1 C38.1 R23.2 SV4.4 U1.A10(1_TVDD) U1.M10(2_TVDD) U14.2(OUT) ; port +3V
+5V: C4.1 C5.1 C6.1 C7.1 C29.1 SV4.6 U1.B5(1_TVCC) U1.B19(1_VCC5) U1.L5(2_TVCC) U1.L19(2_VCC5) U1.M19(3_VCC5) U1.M20(4_VCC5) U12.2(OUT) U19.8(VCC) ; port +5V
+10V: C39.1 C52.1 C53.1 C58.1 C59.1 C64.1 C65.1 C70.1 C71.1 C76.1 C77.1 C82.1 C83.1 C88.1 C89.1 C94.1 C95.1 R34.2 SV4.7 U3.15(VPP) U4.15(VPP) U5.15(VPP) U6.15(VPP) U7.15(VPP) U8.15(VPP) U9.15(VPP) U10.15(VPP) U15.2(OUT) ; port +10V
+11V: C40.1 R24.1 R25.1 R26.1 R27.1 R29.2 SV4.8 U13.2(OUT) ; port +11V
+12V: C26.1 C28.1 C30.1 C32.1 C34.1 C37.1 C48.1 C98.1 C99.1 L1.2 U2.2(IN) U11.3(IN) U12.3(IN) U13.3(IN) U14.3(IN) U15.3(IN) U16.3(VIN) U17.3(VIN)
-5V: C36.1 C100.2(-) SV4.9 U1.A5(1_TVEE) U1.M5(2_TVEE) U19.5(VOUT) ; port -5V
-50V: C50.1 C51.1 C56.1 C57.1 C62.1 C63.1 C68.1 C69.1 C74.1 C75.1 C80.1 C81.1 C86.1 C87.1 C92.1 C93.1 U3.13(VNN) U4.13(VNN) U5.13(VNN) U6.13(VNN) U7.13(VNN) U8.13(VNN) U9.13(VNN) U10.13(VNN) X4.2(KL) ; port -50V
AGND: C9.2 C10.2 C11.2 C34.2 C35.2 C42.2 C43.2 C44.2 N1.18(AGND) R32.1 SV9.5 U17.1(GND) ; port AGND
GND: C1.2 C2.2 C3.2 C4.2 C5.2 C6.2 C7.2 C8.2 C12.2 C13.2 C14.2 C15.2 C17.2 C18.2 C20.2 C23.2 C25.2 C26.2 C27.2 C28.2 C29.2 C30.2 C31.2 C32.2 C33.2 C36.2 C37.2 C38.2 C39.2 C40.2 C41.2 C45.2 C47.2 C48.2 C50.2 C51.2 C52.2 C53.2 C54.2 C55.2 C56.2 C57.2 C58.2 C59.2 C60.2 C61.2 C62.2 C63.2 C64.2 C65.2 C66.2 C67.2 C68.2 C69.2 C70.2 C71.2 C72.2 C73.2 C74.2 C75.2 C76.2 C77.2 C78.2 C79.2 C80.2 C81.2 C82.2 C83.2 C84.2 C85.2 C86.2 C87.2 C88.2 C89.2 C90.2 C91.2 C92.2 C93.2 C94.2 C95.2 C96.2 C97.2 C98.2 C99.2 C100.1(+) C101.2 J1.2 N1.5(DGND) N1.20(DGNDIO) R28.1 R30.1 R35.1 R47.1 SV1.9 SV4.10 SV9.4 U1.A1(1_GND) U1.A13(2_GND) U1.A14(3_GND) U1.A15(4_GND) U1.A16(5_GND) U1.A17(6_GND) U1.A18(7_GND) U1.A27(8_GND) U1.B10(9_GND) U1.B13(10_GND) U1.B14(11_GND) U1.B15(12_GND) U1.B17(13_GND) U1.B18(14_GND) U1.C4(31_GND) U1.C5(32_GND) U1.C6(33_GND) U1.C7(34_GND) U1.C8(35_GND) U1.C9(36_GND) U1.C10(15_GND) U1.C11(16_GND) U1.C12(17_GND) U1.C13(18_GND) U1.C14(19_GND) U1.C15(20_GND) U1.C17(21_GND) U1.C18(22_GND) U1.C19(23_GND) U1.C20(24_GND) U1.C21(25_GND) U1.C22(26_GND) U1.C23(27_GND) U1.C24(28_GND) U1.C25(29_GND) U1.C26(30_GND) U1.D4(53_GND) U1.D5(54_GND) U1.D6(55_GND) U1.D7(56_GND) U1.D8(57_GND) U1.D9(58_GND) U1.D10(37_GND) U1.D11(38_GND) U1.D12(39_GND) U1.D13(40_GND) U1.D14(41_GND) U1.D15(42_GND) U1.D17(43_GND) U1.D18(44_GND) U1.D19(45_GND) U1.D20(46_GND) U1.D21(47_GND) U1.D22(48_GND) U1.D23(49_GND) U1.D24(50_GND) U1.D25(51_GND) U1.D26(52_GND) U1.E4(75_GND) U1.E5(76_GND) U1.E6(77_GND) U1.E7(78_GND) U1.E8(79_GND) U1.E9(80_GND) U1.E10(59_GND) U1.E11(60_GND) U1.E12(61_GND) U1.E13(62_GND) U1.E14(63_GND) U1.E15(64_GND) U1.E17(65_GND) U1.E18(66_GND) U1.E19(67_GND) U1.E20(68_GND) U1.E21(69_GND) U1.E22(70_GND) U1.E23(71_GND) U1.E24(72_GND) U1.E25(73_GND) U1.E26(74_GND) U1.F1(81_GND) U1.F2(91_GND) U1.F3(98_GND) U1.F4(99_GND) U1.F5(100_GND) U1.F6(101_GND) U1.F7(102_GND) U1.F8(103_GND) U1.F9(104_GND) U1.F10(82_GND) U1.F11(83_GND) U1.F12(84_GND) U1.F13(85_GND) U1.F14(86_GND) U1.F15(87_GND) U1.F16(88_GND) U1.F17(89_GND) U1.F19(90_GND) U1.F20(92_GND) U1.F21(93_GND) U1.F22(94_GND) U1.F23(95_GND) U1.F24(96_GND) U1.F25(97_GND) U1.G1(105_GND) U1.G2(115_GND) U1.G3(122_GND) U1.G4(123_GND) U1.G5(124_GND) U1.G6(125_GND) U1.G7(126_GND) U1.G8(127_GND) U1.G9(128_GND) U1.G10(106_GND) U1.G11(107_GND) U1.G12(108_GND) U1.G13(109_GND) U1.G14(110_GND) U1.G15(111_GND) U1.G16(112_GND) U1.G17(113_GND) U1.G19(114_GND) U1.G20(116_GND) U1.G21(117_GND) U1.G22(118_GND) U1.G23(119_GND) U1.G24(120_GND) U1.G25(121_GND) U1.H4(145_GND) U1.H5(146_GND) U1.H6(147_GND) U1.H7(148_GND) U1.H8(149_GND) U1.H9(150_GND) U1.H10(129_GND) U1.H11(130_GND) U1.H12(131_GND) U1.H13(132_GND) U1.H14(133_GND) U1.H15(134_GND) U1.H17(135_GND) U1.H18(136_GND) U1.H19(137_GND) U1.H20(138_GND) U1.H21(139_GND) U1.H22(140_GND) U1.H23(141_GND) U1.H24(142_GND) U1.H25(143_GND) U1.H26(144_GND) U1.J4(167_GND) U1.J5(168_GND) U1.J6(169_GND) U1.J7(170_GND) U1.J8(171_GND) U1.J9(172_GND) U1.J10(151_GND) U1.J11(152_GND) U1.J12(153_GND) U1.J13(154_GND) U1.J14(155_GND) U1.J15(156_GND) U1.J17(157_GND) U1.J18(158_GND) U1.J19(159_GND) U1.J20(160_GND) U1.J21(161_GND) U1.J22(162_GND) U1.J23(163_GND) U1.J24(164_GND) U1.J25(165_GND) U1.J26(166_GND) U1.K4(189_GND) U1.K5(190_GND) U1.K6(191_GND) U1.K7(192_GND) U1.K8(193_GND) U1.K9(194_GND) U1.K10(173_GND) U1.K11(174_GND) U1.K12(175_GND) U1.K13(176_GND) U1.K14(177_GND) U1.K15(178_GND) U1.K17(179_GND) U1.K18(180_GND) U1.K19(181_GND) U1.K20(182_GND) U1.K21(183_GND) U1.K22(184_GND) U1.K23(185_GND) U1.K24(186_GND) U1.K25(187_GND) U1.K26(188_GND) U1.L10(TEN) U1.L13(195_GND) U1.L14(196_GND) U1.L15(197_GND) U1.L17(198_GND) U1.L18(199_GND) U1.L25(200_GND) U1.M1(201_GND) U1.M13(202_GND) U1.M14(203_GND) U1.M15(204_GND) U1.M16(205_GND) U1.M17(206_GND) U1.M18(207_GND) U1.M25(208_GND) U2.4(GND) U3.17(GND) U4.17(GND) U5.17(GND) U6.17(GND) U7.17(GND) U8.17(GND) U9.17(GND) U10.17(GND) U11.1(GND) U12.1(GND) U16.1(GND) U19.3(GND) U20.2(GND) U$1.A7 U$1.A8 U$1.A12 U$1.A16 U$1.A19 U$1.A20 U$1.A24 U$1.A28 U$1.A31 U$1.A32 U$1.A36 U$1.A40 U$1.A43 U$1.A44 U$1.A48 U$1.A52 U$1.A55 U$1.B7 U$1.B10 U$1.B14 U$1.B18 U$1.B19 U$1.B22 U$1.B26 U$1.B30 U$1.B31 U$1.B34 U$1.B38 U$1.B42 U$1.B43 U$1.B46 U$1.B50 U$1.B54 U$1.B55 U$1.C7 U$1.C8 U$1.C12 U$1.C16 U$1.C19 U$1.C20 U$1.C24 U$1.C28 U$1.C31 U$1.C32 U$1.C36 U$1.C40 U$1.C43 U$1.C44 U$1.C48 U$1.C52 U$1.C55 U$1.D7 U$1.D10 U$1.D14 U$1.D18 U$1.D19 U$1.D22 U$1.D26 U$1.D30 U$1.D31 U$1.D34 U$1.D38 U$1.D42 U$1.D43 U$1.D46 U$1.D50 U$1.D54 U$1.D55 U$2.4(GND1) U$2.7(GND2) U$2.12(GND3) X1.2(KL) X2.1(KL) X3.1(KL) X4.1(KL) ; port GND
VDDA: C42.1 FB1.2 N1.15(VDDA) R33.1 SV9.2 ; port VDDA
VDDC: C41.1 FB1.1 N1.6(VDDC) Q1.3(S) SV9.3 ; port VDDC
CH1: U3.11(SW0B) U$1.A54 ; port CH1
CH2: U3.9(SW1B) U$1.A53 ; port CH2
CH3: U3.7(SW2B) U$1.B53 ; port CH3
CH4: U3.5(SW3B) U$1.B52 ; port CH4
CH5: U3.3(SW4B) U$1.B51 ; port CH5
CH6: U3.47(SW5B) U$1.A51 ; port CH6
CH7: U3.45(SW6B) U$1.A50 ; port CH7
CH8: U3.43(SW7B) U$1.A49 ; port CH8
CH9: U3.41(SW8B) U$1.B49 ; port CH9
CH10: U3.39(SW9B) U$1.B48 ; port CH10
CH11: U3.37(SW10B) U$1.B47 ; port CH11
CH12: U3.33(SW11B) U$1.A47 ; port CH12
CH13: U3.31(SW12B) U$1.A46 ; port CH13
CH14: U3.29(SW13B) U$1.A45 ; port CH14
CH15: U3.27(SW14B) U$1.B45 ; port CH15
CH16: U3.25(SW15B) U$1.B44 ; port CH16
CH17: U4.11(SW0B) U$1.A42 ; port CH17
CH18: U4.9(SW1B) U$1.A41 ; port CH18
CH19: U4.7(SW2B) U$1.B41 ; port CH19
CH20: U4.5(SW3B) U$1.B40 ; port CH20
CH21: U4.3(SW4B) U$1.B39 ; port CH21
CH22: U4.47(SW5B) U$1.A39 ; port CH22
CH23: U4.45(SW6B) U$1.A38 ; port CH23
CH24: U4.43(SW7B) U$1.A37 ; port CH24
CH25: U4.41(SW8B) U$1.B37 ; port CH25
CH26: U4.39(SW9B) U$1.B36 ; port CH26
CH27: U4.37(SW10B) U$1.B35 ; port CH27
CH28: U4.33(SW11B) U$1.A35 ; port CH28
CH29: U4.31(SW12B) U$1.A34 ; port CH29
CH30: U4.29(SW13B) U$1.A33 ; port CH30
CH31: U4.27(SW14B) U$1.B33 ; port CH31
CH32: U4.25(SW15B) U$1.B32 ; port CH32
CH33: U5.11(SW0B) U$1.A30 ; port CH33
CH34: U5.9(SW1B) U$1.A29 ; port CH34
CH35: U5.7(SW2B) U$1.B29 ; port CH35
CH36: U5.5(SW3B) U$1.B28 ; port CH36
CH37: U5.3(SW4B) U$1.B27 ; port CH37
CH38: U5.47(SW5B) U$1.A27 ; port CH38
CH39: U5.45(SW6B) U$1.A26 ; port CH39
CH40: U5.43(SW7B) U$1.A25 ; port CH40
CH41: U5.41(SW8B) U$1.B25 ; port CH41
CH42: U5.39(SW9B) U$1.B24 ; port CH42
CH43: U5.37(SW10B) U$1.B23 ; port CH43
CH44: U5.33(SW11B) U$1.A23 ; port CH44
CH45: U5.31(SW12B) U$1.A22 ; port CH45
CH46: U5.29(SW13B) U$1.A21 ; port CH46
CH47: U5.27(SW14B) U$1.B21 ; port CH47
CH48: U5.25(SW15B) U$1.B20 ; port CH48
CH49: U6.11(SW0B) U$1.A18 ; port CH49
CH50: U6.9(SW1B) U$1.A17 ; port CH50
CH51: U6.7(SW2B) U$1.B17 ; port CH51
CH52: U6.5(SW3B) U$1.B16 ; port CH52
CH53: U6.3(SW4B) U$1.B15 ; port CH53
CH54: U6.47(SW5B) U$1.A15 ; port CH54
CH55: U6.45(SW6B) U$1.A14 ; port CH55
CH56: U6.43(SW7B) U$1.A13 ; port CH56
CH57: U6.41(SW8B) U$1.B13 ; port CH57
CH58: U6.39(SW9B) U$1.B12 ; port CH58
CH59: U6.37(SW10B) U$1.B11 ; port CH59
CH60: U6.33(SW11B) U$1.A11 ; port CH60
CH61: R48.2 U6.31(SW12B) U$1.A10 ; port CH61
CH62: R44.2 U6.29(SW13B) U$1.A9 ; port CH62
CH63: R45.2 U6.27(SW14B) U$1.B9 ; port CH63
CH64: R49.2 U6.25(SW15B) U$1.B8 ; port CH64
CH65: R50.2 U7.11(SW0B) U$1.C54 ; port CH65
CH66: R51.2 U7.9(SW1B) U$1.C53 ; port CH66
CH67: R52.2 U7.7(SW2B) U$1.D53 ; port CH67
CH68: R53.2 U7.5(SW3B) U$1.D52 ; port CH68
CH69: U7.3(SW4B) U$1.D51 ; port CH69
CH70: U7.47(SW5B) U$1.C51 ; port CH70
CH71: U7.45(SW6B) U$1.C50 ; port CH71
CH72: U7.43(SW7B) U$1.C49 ; port CH72
CH73: U7.41(SW8B) U$1.D49 ; port CH73
CH74: U7.39(SW9B) U$1.D48 ; port CH74
CH75: U7.37(SW10B) U$1.D47 ; port CH75
CH76: U7.33(SW11B) U$1.C47 ; port CH76
CH77: U7.31(SW12B) U$1.C46 ; port CH77
CH78: U7.29(SW13B) U$1.C45 ; port CH78
CH79: U7.27(SW14B) U$1.D45 ; port CH79
CH80: U7.25(SW15B) U$1.D44 ; port CH80
CH81: U8.11(SW0B) U$1.C42 ; port CH81
CH82: U8.9(SW1B) U$1.C41 ; port CH82
CH83: U8.7(SW2B) U$1.D41 ; port CH83
CH84: U8.5(SW3B) U$1.D40 ; port CH84
CH85: U8.3(SW4B) U$1.D39 ; port CH85
CH86: U8.47(SW5B) U$1.C39 ; port CH86
CH87: U8.45(SW6B) U$1.C38 ; port CH87
CH88: U8.43(SW7B) U$1.C37 ; port CH88
CH89: U8.41(SW8B) U$1.D37 ; port CH89
CH90: U8.39(SW9B) U$1.D36 ; port CH90
CH91: U8.37(SW10B) U$1.D35 ; port CH91
CH92: U8.33(SW11B) U$1.C35 ; port CH92
CH93: U8.31(SW12B) U$1.C34 ; port CH93
CH94: U8.29(SW13B) U$1.C33 ; port CH94
CH95: U8.27(SW14B) U$1.D33 ; port CH95
CH96: U8.25(SW15B) U$1.D32 ; port CH96
CH97: U9.11(SW0B) U$1.C30 ; port CH97
CH98: U9.9(SW1B) U$1.C29 ; port CH98
CH99: U9.7(SW2B) U$1.D29 ; port CH99
CH100: U9.5(SW3B) U$1.D28 ; port CH100
CH101: U9.3(SW4B) U$1.D27 ; port CH101
CH102: U9.47(SW5B) U$1.C27 ; port CH102
CH103: U9.45(SW6B) U$1.C26 ; port CH103
CH104: U9.43(SW7B) U$1.C25 ; port CH104
CH105: U9.41(SW8B) U$1.D25 ; port CH105
CH106: U9.39(SW9B) U$1.D24 ; port CH106
CH107: U9.37(SW10B) U$1.D23 ; port CH107
CH108: U9.33(SW11B) U$1.C23 ; port CH108
CH109: U9.31(SW12B) U$1.C22 ; port CH109
CH110: U9.29(SW13B) U$1.C21 ; port CH110
CH111: U9.27(SW14B) U$1.D21 ; port CH111
CH112: U9.25(SW15B) U$1.D20 ; port CH112
CH113: U10.11(SW0B) U$1.C18 ; port CH113
CH114: U10.9(SW1B) U$1.C17 ; port CH114
CH115: U10.7(SW2B) U$1.D17 ; port CH115
CH116: U10.5(SW3B) U$1.D16 ; port CH116
CH117: U10.3(SW4B) U$1.D15 ; port CH117
CH118: U10.47(SW5B) U$1.C15 ; port CH118
CH119: U10.45(SW6B) U$1.C14 ; port CH119
CH120: U10.43(SW7B) U$1.C13 ; port CH120
CH121: U10.41(SW8B) U$1.D13 ; port CH121
CH122: U10.39(SW9B) U$1.D12 ; port CH122
CH123: U10.37(SW10B) U$1.D11 ; port CH123
CH124: U10.33(SW11B) U$1.C11 ; port CH124
CH125: U10.31(SW12B) U$1.C10 ; port CH125
CH126: U10.29(SW13B) U$1.C9 ; port CH126
CH127: U10.27(SW14B) U$1.D9 ; port CH127
CH128: U10.25(SW15B) U$1.D8 ; port CH128
CK_N: J2.G3 U1.M24(CLKIN-) ; port CLKIN-  [also labelled CLKIN-]
CK_P: J2.G2 U1.L24(CLKIN+) ; port CLKIN+  [also labelled CLKIN+]
CL+: R25.2 SV2.6 U1.A20(CI+) ; port CL+
CL-: R24.2 SV2.7 U1.B20(CI-) ; port CL-
CLK: SV10.19 SV10.20 U$2.1(CLKIN) ; port CLK
CLK1: U3.20(CLK) U$2.3(Y0) ; port CLK1
CLK2: U4.20(CLK) U$2.16(Y1) ; port CLK2
CLK3: U5.20(CLK) U$2.13(Y2) ; port CLK3
CLK4: U6.20(CLK) U$2.15(Y3) ; port CLK4
CLK5: U7.20(CLK) U$2.6(Y4) ; port CLK5
CLK6: U8.20(CLK) U$2.11(Y5) ; port CLK6
CLK7: U9.20(CLK) U$2.8(Y6) ; port CLK7
CLK8: U10.20(CLK) U$2.9(Y7) ; port CLK8
CLK_N: J2.G7 U1.F28(CLKOUT-) ; port CLKOUT-
CLK_P: J2.G6 U1.F27(CLKOUT+) ; port CLKOUT+
CLR1: SV10.2 U3.22(CLR) ; port CLR1
CLR2: SV10.4 U4.22(CLR) ; port CLR2
CLR3: SV10.6 U5.22(CLR) ; port CLR3
CLR4: SV10.8 U6.22(CLR) ; port CLR4
CLR5: SV10.10 U7.22(CLR) ; port CLR5
CLR6: SV10.12 U8.22(CLR) ; port CLR6
CLR7: SV10.14 U9.22(CLR) ; port CLR7
CLR8: SV10.16 U10.22(CLR) ; port CLR8
CQ+: R27.2 SV2.4 U1.A21(CQ+) ; port CQ+
CQ-: R26.2 SV2.5 U1.B21(CQ-) ; port CQ-
DIN1: SV10.17 U3.19(DIN) ; port DIN1
DOUT1: U3.23(DOUT) U4.19(DIN) ; port DOUT1
DOUT2: U4.23(DOUT) U5.19(DIN) ; port DOUT2
DOUT3: U5.23(DOUT) U6.19(DIN) ; port DOUT3
DOUT4: U6.23(DOUT) U7.19(DIN) ; port DOUT4
DOUT5: U7.23(DOUT) U8.19(DIN) ; port DOUT5
DOUT6: U8.23(DOUT) U9.19(DIN) ; port DOUT6
DOUT7: U9.23(DOUT) U10.19(DIN) ; port DOUT7
DOUT8: SV10.18 U10.23(DOUT) ; port DOUT8
EN1: SV9.6 U20.4(EN) ; port EN1
FRAME+: SV6.1 U1.G27(FRAME+) ; port FRAME+
FRAME-: SV6.2 U1.G28(FRAME-) ; port FRAME-
ID1: R36.1 SV1.1 U$1.A63 ; port ID1
ID2: R37.1 SV1.2 U$1.A59 ; port ID2
ID3: R38.1 SV1.3 U$1.B63 ; port ID3
ID4: R39.1 SV1.4 U$1.B59 ; port ID4
ID5: R40.1 SV1.5 U$1.C63 ; port ID5
ID6: R41.1 SV1.6 U$1.C59 ; port ID6
ID7: R42.1 SV1.7 U$1.D63 ; port ID7
ID8: R43.1 SV1.8 U$1.D59 ; port ID8
LO+: SV2.1 U1.A22(LO+) ; port LO+
LO-: SV2.2 U1.B22(LO-) ; port LO-
LOON: SV2.3 U1.B23(LOON) ; port LOON
N0: PULSE_1.3 R15.1 ; port N0
N1: PULSE_1.7 R1.1 ; port N1
N2: PULSE_1.11 R4.2 ; port N2
N3: PULSE_1.15 R6.2 ; port N3
N4: PULSE_5.3 R8.2 ; port N4
N5: PULSE_5.7 R10.2 ; port N5
N6: PULSE_5.11 R12.2 ; port N6
N7: PULSE_5.15 R14.2 ; port N7
O1_N: J2.H8 U1.B28(OUT1-) ; port O1-
O1_P: J2.H7 U1.B27(OUT1+) ; port O1+
O2_N: J2.G10 U1.C28(OUT2-) ; port O2-
O2_P: J2.G9 U1.C27(OUT2+) ; port O2+
O3_N: J2.H11 U1.D28(OUT3-) ; port O3-
O3_P: J2.H10 U1.D27(OUT3+) ; port O3+
O4_N: J2.G13 U1.E28(OUT4-) ; port O4-
O4_P: J2.G12 U1.E27(OUT4+) ; port O4+
O5_N: J2.H14 U1.H28(OUT5-) ; port O5-
O5_P: J2.H13 U1.H27(OUT5+) ; port O5+
O6_N: J2.G16 U1.J28(OUT6-) ; port O6-
O6_P: J2.G15 U1.J27(OUT6+) ; port O6+
O7_N: J2.H17 U1.K28(OUT7-) ; port O7-
O7_P: J2.H16 U1.K27(OUT7+) ; port O7+
O8_N: J2.G19 U1.L28(OUT8-) ; port O8-
O8_P: J2.G18 U1.L27(OUT8+) ; port O8+
P0: PULSE_1.1 R16.1 ; port P0
P1: PULSE_1.5 R2.1 ; port P1
P2: PULSE_1.9 R3.2 ; port P2
P3: PULSE_1.13 R5.2 ; port P3
P4: PULSE_5.1 R7.2 ; port P4
P5: PULSE_5.5 R9.2 ; port P5
P6: PULSE_5.9 R11.2 ; port P6
P7: PULSE_5.13 R13.2 ; port P7
PLL_CLK+: C49.2 J2.H4 SV7.1 ; port PLL_CLK+
PLL_CLK-: C16.2 J2.H5 SV7.2 ; port PLL_CLK-
PO1: R48.1 U1.B1(TR1) U3.12(SW0A) U3.42(SW8A) U4.12(SW0A) U4.42(SW8A) U5.12(SW0A) U5.42(SW8A) U6.12(SW0A) U6.42(SW8A) U7.12(SW0A) U7.42(SW8A) U8.12(SW0A) U8.42(SW8A) U9.12(SW0A) U9.42(SW8A) U10.12(SW0A) U10.42(SW8A) ; port PO1
PO2: R44.1 U1.C1(TR2) U3.10(SW1A) U3.40(SW9A) U4.10(SW1A) U4.40(SW9A) U5.10(SW1A) U5.40(SW9A) U6.10(SW1A) U6.40(SW9A) U7.10(SW1A) U7.40(SW9A) U8.10(SW1A) U8.40(SW9A) U9.10(SW1A) U9.40(SW9A) U10.10(SW1A) U10.40(SW9A) ; port PO2
PO3: R45.1 U1.D1(TR3) U3.8(SW2A) U3.38(SW10A) U4.8(SW2A) U4.38(SW10A) U5.8(SW2A) U5.38(SW10A) U6.8(SW2A) U6.38(SW10A) U7.8(SW2A) U7.38(SW10A) U8.8(SW2A) U8.38(SW10A) U9.8(SW2A) U9.38(SW10A) U10.8(SW2A) U10.38(SW10A) ; port PO3
PO4: R49.1 U1.E1(TR4) U3.6(SW3A) U3.34(SW11A) U4.6(SW3A) U4.34(SW11A) U5.6(SW3A) U5.34(SW11A) U6.6(SW3A) U6.34(SW11A) U7.6(SW3A) U7.34(SW11A) U8.6(SW3A) U8.34(SW11A) U9.6(SW3A) U9.34(SW11A) U10.6(SW3A) U10.34(SW11A) ; port PO4
PO5: R50.1 U1.H1(TR5) U3.4(SW4A) U3.32(SW12A) U4.4(SW4A) U4.32(SW12A) U5.4(SW4A) U5.32(SW12A) U6.4(SW4A) U6.32(SW12A) U7.4(SW4A) U7.32(SW12A) U8.4(SW4A) U8.32(SW12A) U9.4(SW4A) U9.32(SW12A) U10.4(SW4A) U10.32(SW12A) ; port PO5
PO6: R51.1 U1.J1(TR6) U3.30(SW13A) U3.48(SW5A) U4.30(SW13A) U4.48(SW5A) U5.30(SW13A) U5.48(SW5A) U6.30(SW13A) U6.48(SW5A) U7.30(SW13A) U7.48(SW5A) U8.30(SW13A) U8.48(SW5A) U9.30(SW13A) U9.48(SW5A) U10.30(SW13A) U10.48(SW5A) ; port PO6
PO7: R52.1 U1.K1(TR7) U3.28(SW14A) U3.46(SW6A) U4.28(SW14A) U4.46(SW6A) U5.28(SW14A) U5.46(SW6A) U6.28(SW14A) U6.46(SW6A) U7.28(SW14A) U7.46(SW6A) U8.28(SW14A) U8.46(SW6A) U9.28(SW14A) U9.46(SW6A) U10.28(SW14A) U10.46(SW6A) ; port PO7
PO8: R53.1 U1.L1(TR8) U3.26(SW15A) U3.44(SW7A) U4.26(SW15A) U4.44(SW7A) U5.26(SW15A) U5.44(SW7A) U6.26(SW15A) U6.44(SW7A) U7.26(SW15A) U7.44(SW7A) U8.26(SW15A) U8.44(SW7A) U9.26(SW15A) U9.44(SW7A) U10.26(SW15A) U10.44(SW7A) ; port PO8
TCLK+: J2.D8 SV2.8 U1.M12(TCLK+) ; port TCLK+
TCLK-: J2.D9 SV2.9 U1.L12(TCLK-) ; port TCLK-
TINN1: PULSE_1.4 U1.B6(TINN1) ; port TINN1
TINN2: PULSE_1.8 U1.B7(TINN2) ; port TINN2
TINN3: PULSE_1.12 U1.B8(TINN3) ; port TINN3
TINN4: PULSE_1.16 U1.B9(TINN4) ; port TINN4
TINN5: PULSE_5.4 U1.L6(TINN5) ; port TINN5
TINN6: PULSE_5.8 U1.L7(TINN6) ; port TINN6
TINN7: PULSE_5.12 U1.L8(TINN7) ; port TINN7
TINN8: PULSE_5.16 U1.L9(TINN8) ; port TINN8
TINP1: PULSE_1.2 U1.A6(TINP1) ; port TINP1
TINP2: PULSE_1.6 U1.A7(TINP2) ; port TINP2
TINP3: PULSE_1.10 U1.A8(TINP3) ; port TINP3
TINP4: PULSE_1.14 U1.A9(TINP4) ; port TINP4
TINP5: PULSE_5.2 U1.M6(TINP5) ; port TINP5
TINP6: PULSE_5.6 U1.M7(TINP6) ; port TINP6
TINP7: PULSE_5.10 U1.M8(TINP7) ; port TINP7
TINP8: PULSE_5.14 U1.M9(TINP8) ; port TINP8
~LE1: SV10.1 U3.21(~{LE}) ; port ~LE1
~LE2: SV10.3 U4.21(~{LE}) ; port ~LE2
~LE3: SV10.5 U5.21(~{LE}) ; port ~LE3
~LE4: SV10.7 U6.21(~{LE}) ; port ~LE4
~LE5: SV10.9 U7.21(~{LE}) ; port ~LE5
~LE6: SV10.11 U8.21(~{LE}) ; port ~LE6
~LE7: SV10.13 U9.21(~{LE}) ; port ~LE7
~LE8: SV10.15 U10.21(~{LE}) ; port ~LE8
NetC16_1: C16.1 N1.14(PLL_CLK-)
NetC17_1: C17.1 U1.A25(REFIO)
NetC18_1: C18.1 C19.1 C20.1 C21.1 U1.A3(1_TVPPA) U1.B3(2_TVPPA) U1.C3(3_TVPPA) U1.D3(4_TVPPA) U1.E3(5_TVPPA) U1.H3(1_TVPPB) U1.J3(2_TVPPB) U1.K3(3_TVPPB) U1.L3(4_TVPPB) U1.M3(5_TVPPB) X2.2(KL)
NetC19_2: C19.2 U1.A4(TVGPA)
NetC21_2: C21.2 U1.M4(TVGPB)
NetC22_1: C22.1 C23.1 C24.1 C25.1 U1.A2(1_TVNNA) U1.B2(2_TVNNA) U1.C2(3_TVNNA) U1.D2(4_TVNNA) U1.E2(5_TVNNA) U1.H2(1_TVNNB) U1.J2(2_TVNNB) U1.K2(3_TVNNB) U1.L2(4_TVNNB) U1.M2(5_TVNNB) X3.2(KL)
NetC22_2: C22.2 U1.B4(TVGNA)
NetC24_2: C24.2 U1.L4(TVGNB)
NetC43_1: C43.1 N1.16(PLL_VIN) R31.1 R32.2
NetC44_1: C44.1 N1.17(PLL_LIN) R33.2
NetC46_1: C46.1(+) U19.2(CAP+)
NetC46_2: C46.2(-) U19.4(CAP-)
NetC49_1: C49.1 N1.13(PLL_CLK+)
NetJ1_1: J1.1 L1.1 X1.1(KL)
NetN1_1: N1.1(N1) R1.2
NetN1_2: N1.2(P1) R2.2
NetN1_3: N1.3(N0) R15.2
NetN1_4: N1.4(P0) R16.2
NetN1_7: N1.7(TX_EN) R17.2
NetN1_8: N1.8(RST) R18.2
NetN1_9: N1.9(SRD) R19.2
NetN1_10: N1.10(SLE) R20.2
NetN1_11: N1.11(SWR) R21.2
NetN1_12: N1.12(SCLK) R22.2
NetN1_21: N1.21(N7) R14.1
NetN1_22: N1.22(P7) R13.1
NetN1_23: N1.23(N6) R12.1
NetN1_24: N1.24(P6) R11.1
NetN1_25: N1.25(N5) R10.1
NetN1_26: N1.26(P5) R9.1
NetN1_27: N1.27(N4) R8.1
NetN1_28: N1.28(P4) R7.1
NetN1_29: N1.29(N3) R6.1
NetN1_30: N1.30(P3) R5.1
NetN1_31: N1.31(N2) R4.1
NetN1_32: N1.32(P2) R3.1
NetQ1_1: Q1.1(G) U20.5(GATE)
NetR17_1: R17.1 SV7.8
NetR18_1: R18.1 SV7.7
NetR19_1: R19.1 SV7.6
NetR20_1: R20.1 SV7.5
NetR21_1: R21.1 SV7.4
NetR22_1: R22.1 SV7.3
NetR23_1: R23.1 R30.2 U14.1(ADJ)
NetR28_2: R28.2 R29.1 U13.1(ADJ)
NetR34_1: R34.1 R35.2 U15.1(ADJ)
NetR46_1: R46.1 R47.2 U20.3(SETV)
NetSV3_1: SV3.1 U1.A12(TCC1)
NetSV3_2: SV3.2 U1.B12(TCC0)
NetSV3_3: SV3.3 U1.A11(TMODE1)
NetSV3_4: SV3.4 U1.B11(TMODE0)
NetSV5_1: SV5.1 U1.M27(~{CS})
NetSV5_2: SV5.2 U1.M26(SCLK)
NetSV5_3: SV5.3 U1.L26(SDIO)
NetSV8_1: SV8.1 U1.L11(THP)
NetSV8_2: SV8.2 U1.M11(TSYNC)
NetSV8_3: SV8.3 U1.L21(GC-)
NetSV8_4: SV8.4 U1.M21(GC+)
NetSV8_5: SV8.5 U1.A26(CWD)
NetSV8_6: SV8.6 U1.B26(SHDN)

Not connected (* = marked no-connect by the designer): J1 3; J2 A1 A2 A3 A4 A5 A6 A7 A8 A9 A10 A11 A12 A13 A14 A15 A16 A17 A18 A19 A20 A21 A22 A23 A24 A25 A26 A27 A28 A29 A30 A31 A32 A33 A34 A35 A36 A37 A38 A39 A40 B1 B2 B3 B4 B5 B6 B7 B8 B9 B10 B11 B12 B13 B14 B15 B16 B17 B18 B19 B20 B21 B22 B23 B24 B25 B26 B27 B28 B29 B30 B31 B32 B33 B34 B35 B36 B37 B38 B39 B40 C1 C2 C3 C4 C5 C6 C7 C8 C9 C10 C11 C12 C13 C14 C15 C16 C17 C18 C19 C20 C21 C22 C23 C24 C25 C26 C27 C28 C29 C30 C31 C32 C33 C34 C35 C36 C37 C38 C39 C40 D1 D2 D3 D4 D5 D6 D7 D10 D11 D12 D13 D14 D15 D16 D17 D18 D19 D20 D21 D22 D23 D24 D25 D26 D27 D28 D29 D30 D31 D32 D33 D34 D35 D36 D37 D38 D39 D40 E1 E2 E3 E4 E5 E6 E7 E8 E9 E10 E11 E12 E13 E14 E15 E16 E17 E18 E19 E20 E21 E22 E23 E24 E25 E26 E27 E28 E29 E30 E31 E32 E33 E34 E35 E36 E37 E38 E39 E40 F1 F2 F3 F4 F5 F6 F7 F8 F9 F10 F11 F12 F13 F14 F15 F16 F17 F18 F19 F20 F21 F22 F23 F24 F25 F26 F27 F28 F29 F30 F31 F32 F33 F34 F35 F36 F37 F38 F39 F40 G1 G4 G5 G8 G11 G14 G17 G20 G21 G22 G23 G24 G25 G26 G27 G28 G29 G30 G31 G32 G33 G34 G35 G36 G37 G38 G39 G40 H1 H2 H3 H6 H9 H12 H15 H18 H19 H20 H21 H22 H23 H24 H25 H26 H27 H28 H29 H30 H31 H32 H33 H34 H35 H36 H37 H38 H39 H40; N1 0; SV2 10; SV6 3 4; U1 A24(N.C.) B16(INB1) B25(I.C.) C16(INB2) D16(INB3) E16(INB4) F18(1_AG) G18(2_AG) H16(INB5) J16(INB6) K16(INB7) L16(INB8); U2 1(IC_2) 3(NR) 5(TRIM) 7(IC_3) 8(IC); U3 1(NC_2) 2(NC_3) 14(NC_4) 16(NC_5) 24(NC_6) 35(NC_7) 36(NC); U4 1(NC_2) 2(NC_3) 14(NC_4) 16(NC_5) 24(NC_6) 35(NC_7) 36(NC); U5 1(NC_2) 2(NC_3) 14(NC_4) 16(NC_5) 24(NC_6) 35(NC_7) 36(NC); U6 1(NC_2) 2(NC_3) 14(NC_4) 16(NC_5) 24(NC_6) 35(NC_7) 36(NC); U7 1(NC_2) 2(NC_3) 14(NC_4) 16(NC_5) 24(NC_6) 35(NC_7) 36(NC); U8 1(NC_2) 2(NC_3) 14(NC_4) 16(NC_5) 24(NC_6) 35(NC_7) 36(NC); U9 1(NC_2) 2(NC_3) 14(NC_4) 16(NC_5) 24(NC_6) 35(NC_7) 36(NC); U10 1(NC_2) 2(NC_3) 14(NC_4) 16(NC_5) 24(NC_6) 35(NC_7) 36(NC); U19 1(NC) 6(LV) 7(OSC); U$1 A1 A2 A3 A4 A5 A6 A56 A57 A58 A60 A61 A62 A64 A65 B1 B2 B3 B4 B5 B6 B56 B57 B58 B60 B61 B62 B64 B65 C1 C2 C3 C4 C5 C6 C56 C57 C58 C60 C61 C62 C64 C65 D1 D2 D3 D4 D5 D6 D56 D57 D58 D60 D61 D62 D64 D65

## Layout directives
differential pair: CK_N, CK_P, CLK_N, CLK_P, O1_N, O1_P, O2_N, O2_P, O3_N, O3_P, O4_N, O4_P, O5_N, O5_P, O6_N, O6_P, O7_N, O7_P, O8_N, O8_P

## Notes on the sheet
- MAX2082 Transceiver Circuit
- TX Beamformer Circuit
- Power Supply
- Analog supply
- Digital supply
- Dynamic routing circuit
- Probe connector
- Do not populate(DNP) the resistors
- Indian Institute of Science
- Ultrasound Imaging - v1.0

## Library data of the parts
C1-C45 C47-C99 C101 = C-USC0805: CAPACITOR, American symbol
C46 C100 = CPOL-EUE2.5-6: POLARIZED CAPACITOR, European symbol
FB1 = TDK_MPZ1608S101ATAH0TDK_MPZ1608S101ATAH0_0_0: Chip bead for power line
J1 = DCJ0202: DC POWER JACK   Source: DCJ0202.pdf
J2 = ASP-134488-01: Board-To-Board Connector, Vita 57 XMC, ASP Series, Surface Mount, Header, 400, 1.27 mm
L1 = WURTH_ELECTRONICS_742792031WURTH_ELECTRONICS_742792031_0_0: PAS-IND-INDUCTOR-2
N1 = LM96570SQE/NOPB
PULSE_1 PULSE_5 = JP8Q: JUMPER
Q1 = ON_SEMICONDUCTOR_NTF3055L108T1GON_SEMICONDUCTOR_NTF3055L108T1G_0_0: ONSC-NMOS-G1D2S3D4-4
R1-R53 = R-US_M0805: RESISTOR, American symbol
SV1 = MA09-1: PIN HEADER
SV2 SV4 = MA10-1: PIN HEADER
SV3 SV6 = MA04-1: PIN HEADER
SV5 = MA03-1: PIN HEADER
SV7 = MA08-1: PIN HEADER
SV8 SV9 = MA06-1: PIN HEADER
SV10 = MA10-2: PIN HEADER
U1 = MAXIM_ELECTRONICS_MAX2082CXD+MAXIM_ELECTRONICS_MAX2082CXD+_0_0: IC TXRX RS232 5V 336CSBGA
U2 = MAX6225BCSA+21-0041B_8-M
U3-U10 = MAX4968AECM+21-0054G_48-M
U11 = TI_NATIONAL_SEMICONDUCTOR_LM1117T-3.3-NOPBTI_NATIONAL_SEMICONDUCTOR_LM1117T-3.3-NOPB_0_0: PM-REG-LM1086-SIL3
U12 = TI_NATIONAL_SEMICONDUCTOR_LM1117T-5.0-NOPBTI_NATIONAL_SEMICONDUCTOR_LM1117T-5.0-NOPB_0_0: PM-REG-LM1086-SIL3
U13-U15 = TI_NATIONAL_SEMICONDUCTOR_LM1117T-ADJ-NOPBTI_NATIONAL_SEMICONDUCTOR_LM1117T-ADJ-NOPB_0_0: PM-REG-LM1086ADJ-SIL3
U16 U17 = STMICROELECTRONICS_LD1117V18STMICROELECTRONICS_LD1117V18_0_0: PM-REG-LD1117V-SIL3
U19 = TEXAS_INSTRUMENTS_TL7660CDGKRTEXAS_INSTRUMENTS_TL7660CDGKR_0_1: TI-7660-8
U20 = MAX6819UT+T21-0058I-L
U$1 = PROBE_CONNECTOR: TE Connectivity AMP Connectors 6565204-1
U$2 = 5PB1108PGGI
X1-X4 = AK500/2: CONNECTOR